# Altium project IMX6 DEV BOARD.PrjPcb (part 2 of 4)

## Sheet dram.SchDoc
size A1; SheetNumber: 7; SheetTotal: 21
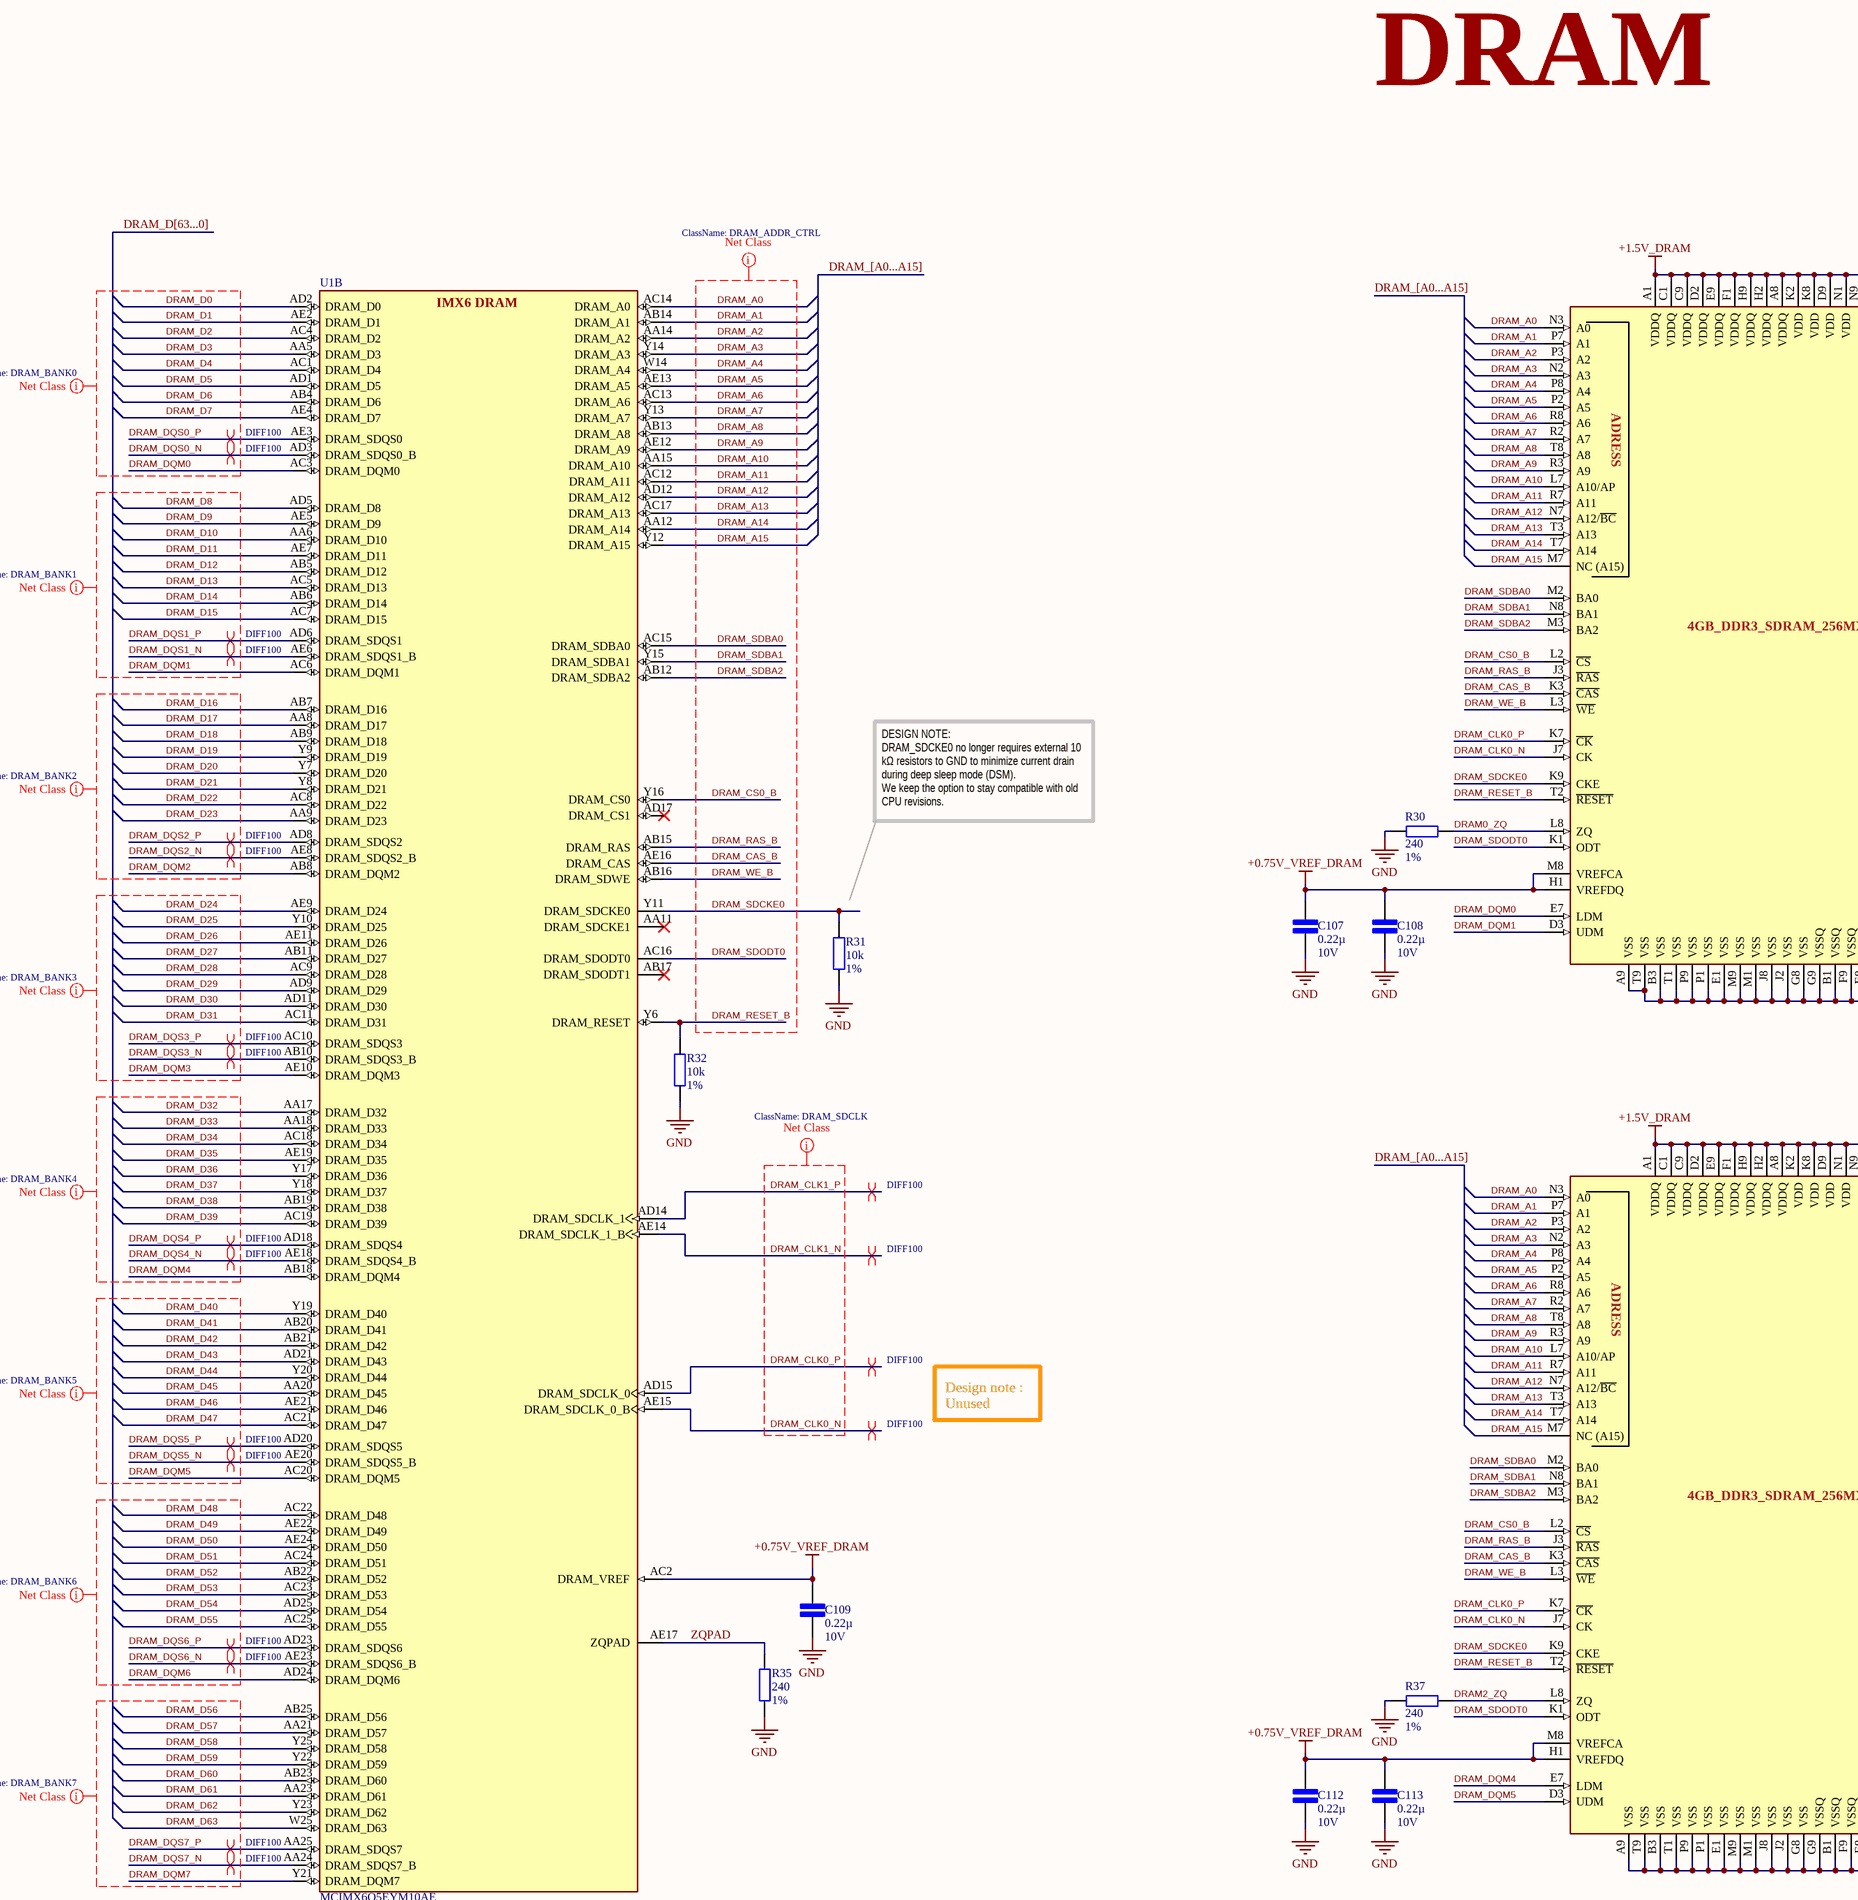
[diagram p6: dram.SchDoc, top left]
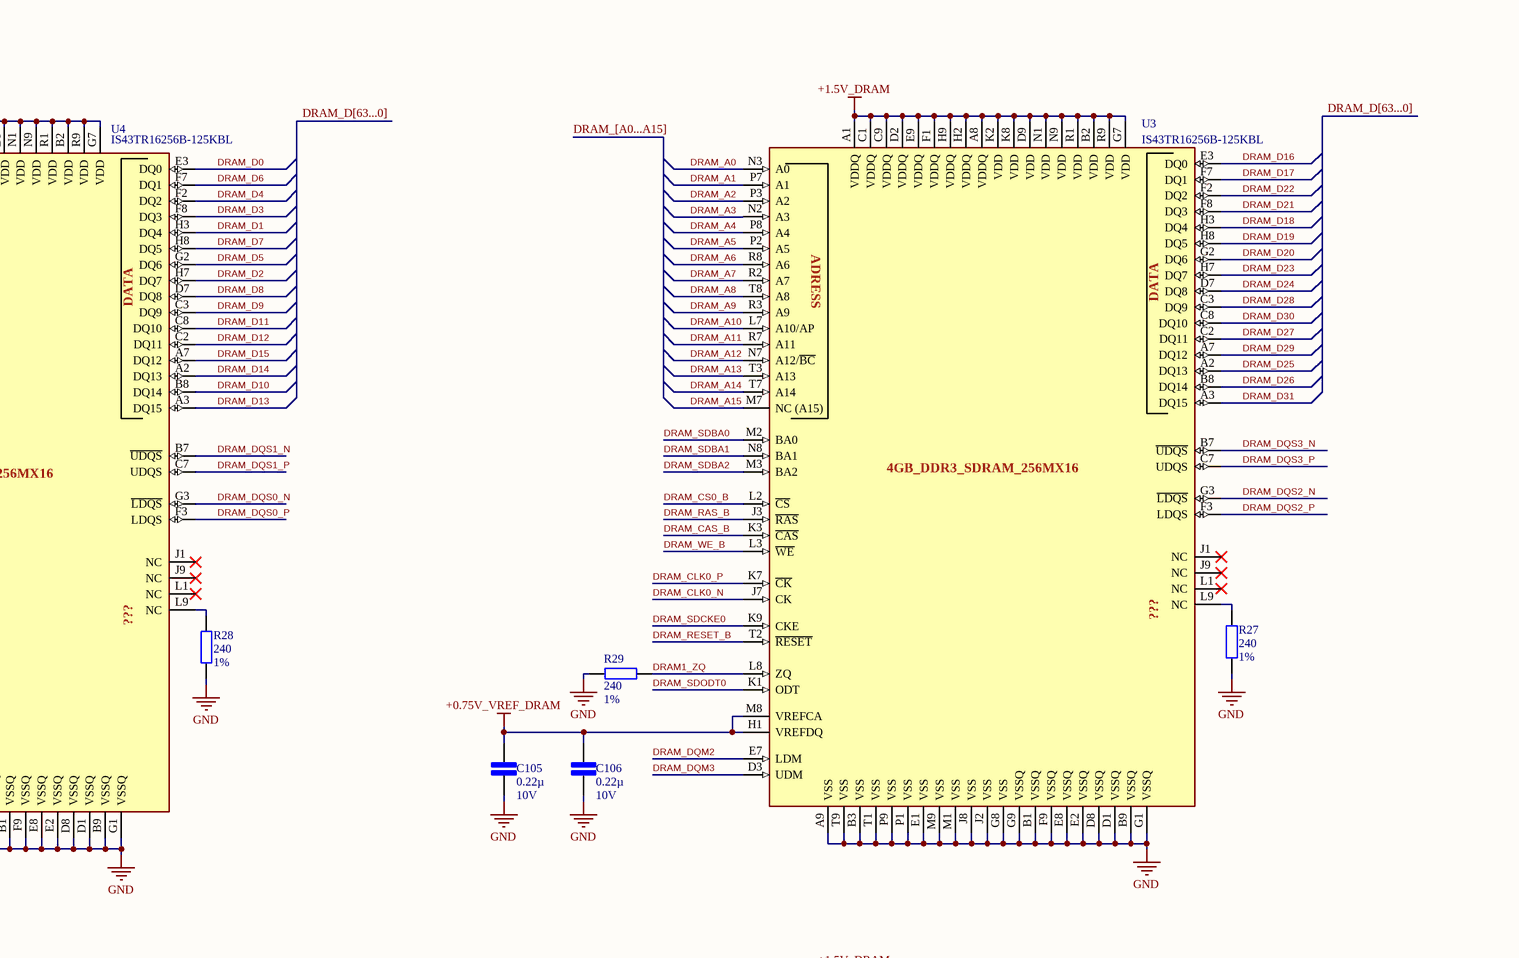
[diagram p7: dram.SchDoc, top right]
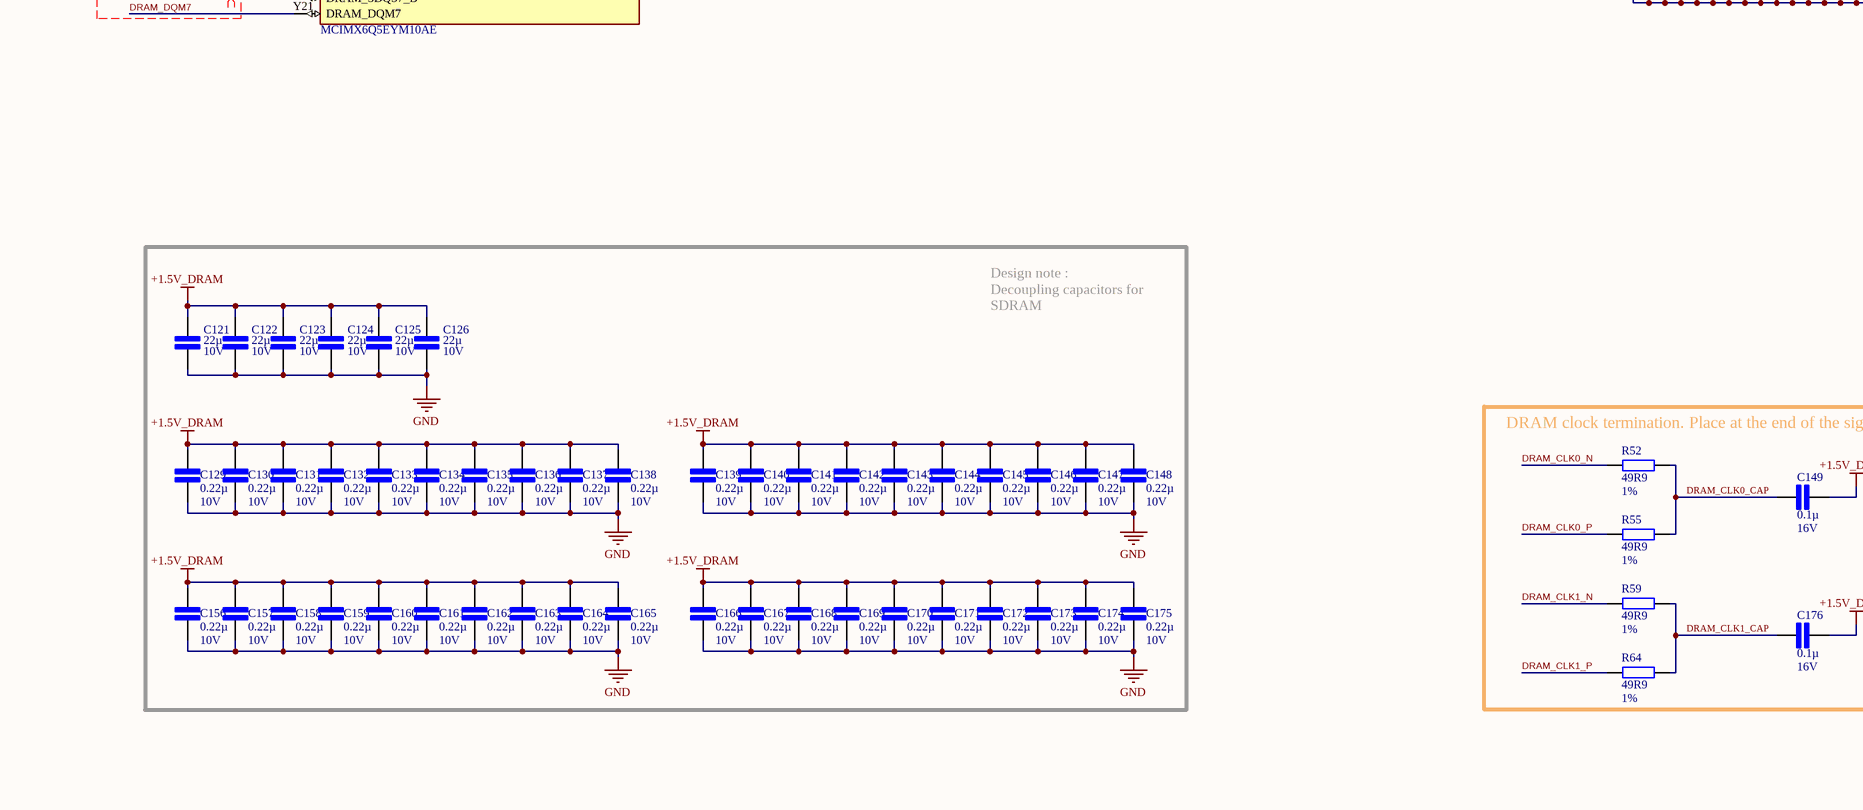
[diagram p8: dram.SchDoc, bottom left]
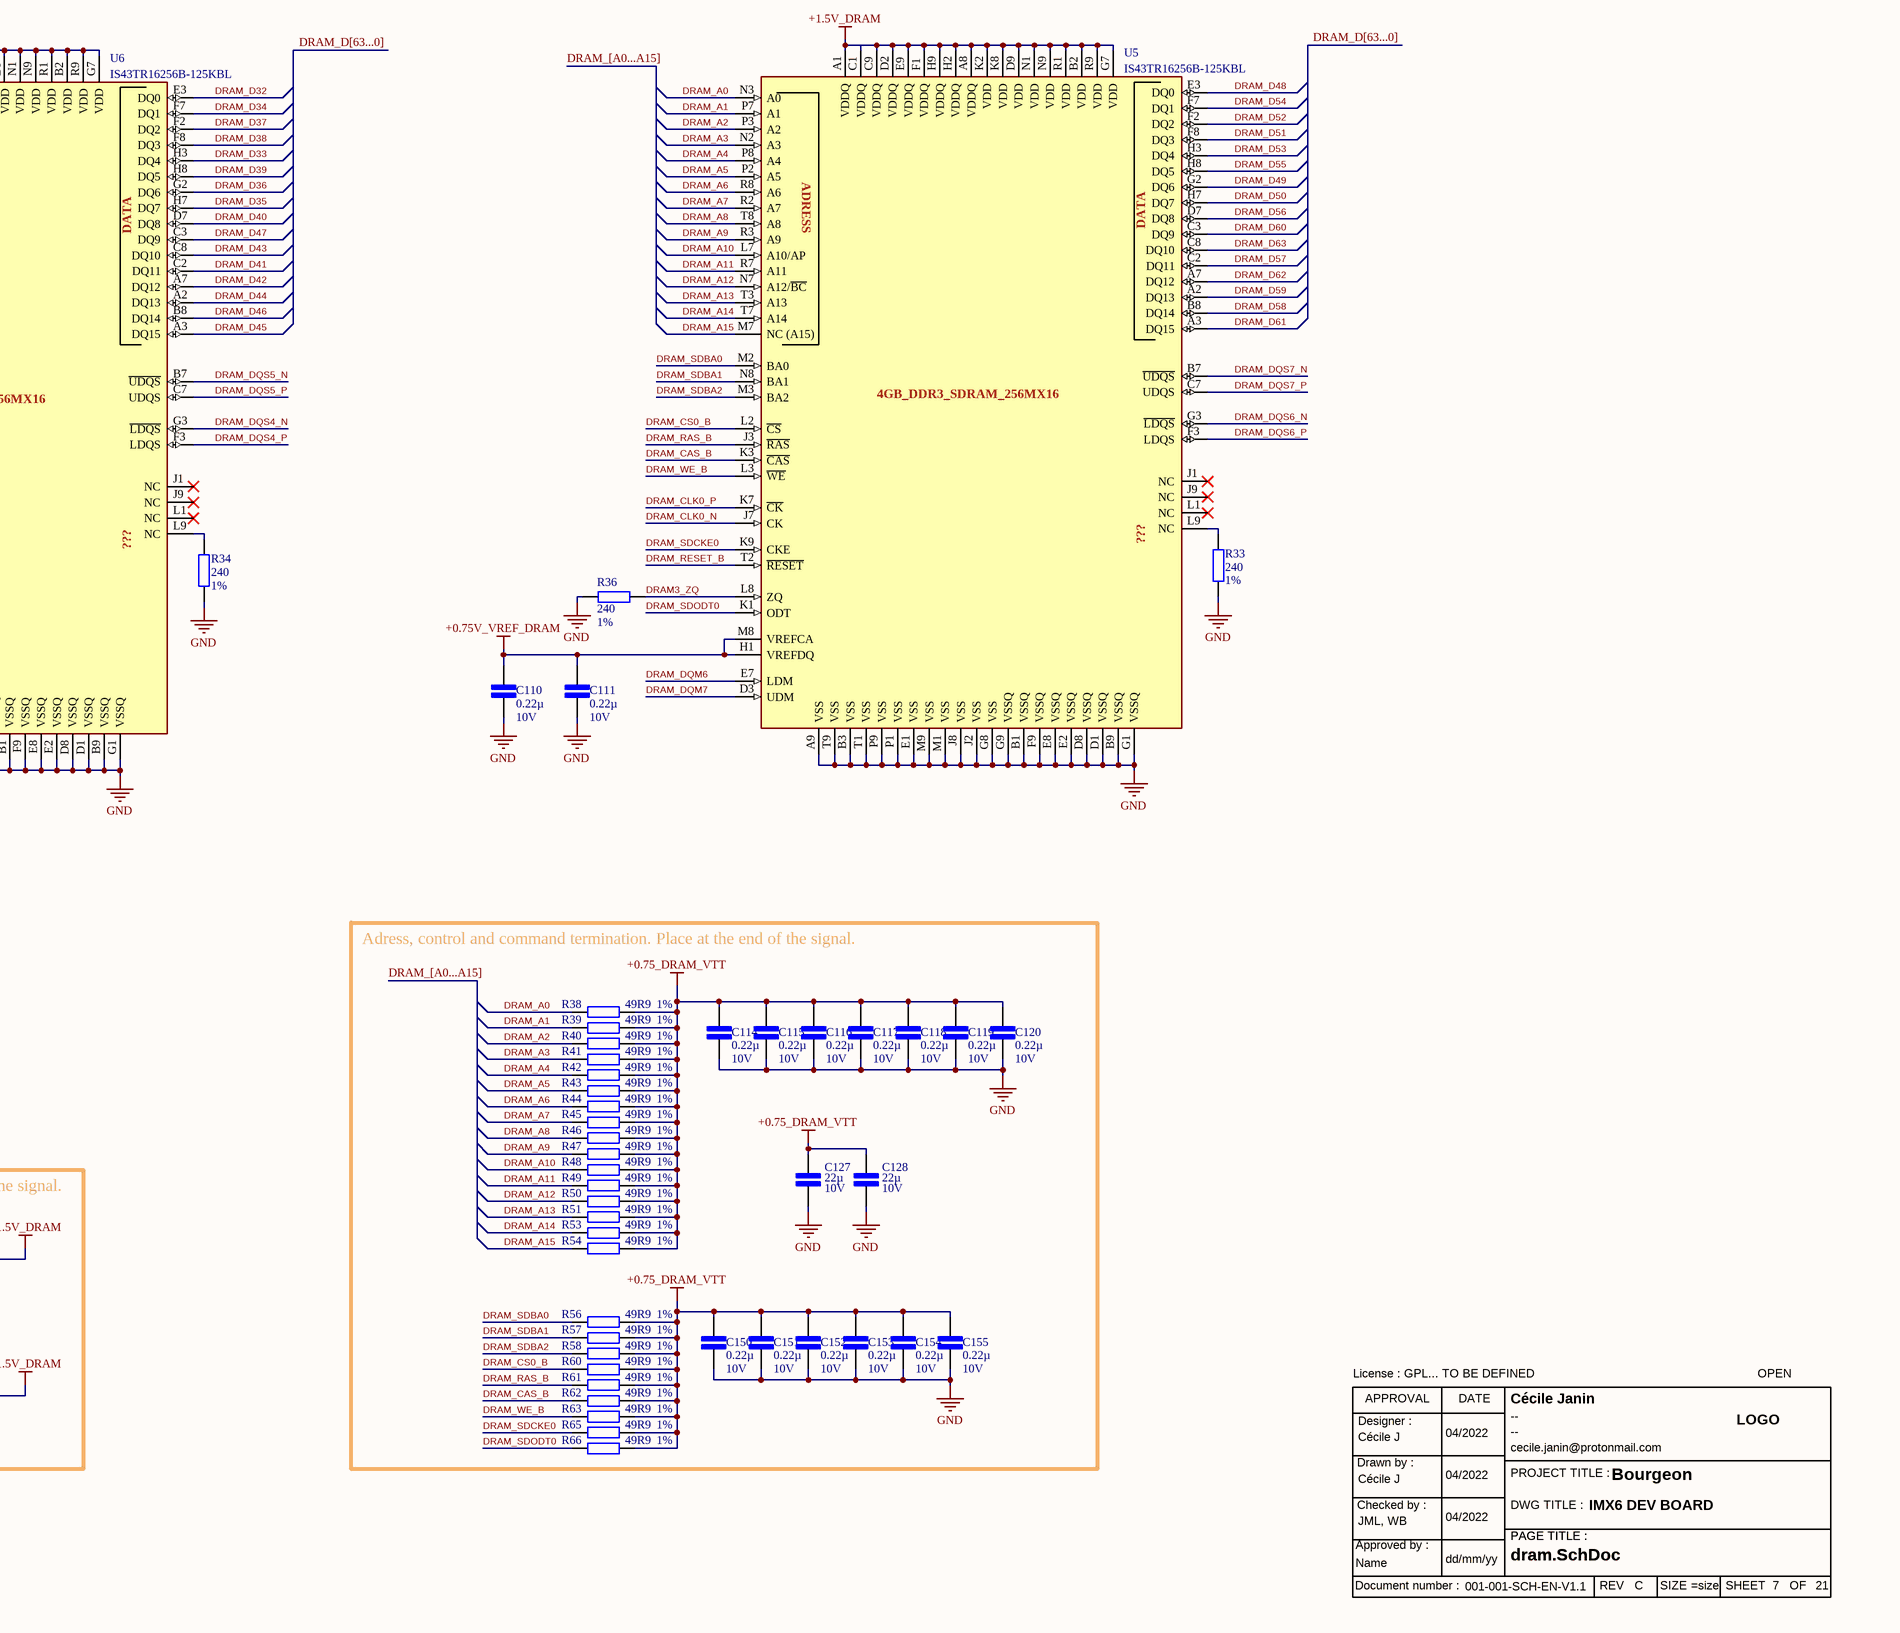
[diagram p9: dram.SchDoc, bottom right]

### Parts
C105  0.22µ  Tension du diélectrique: 10V  [Cap cer 0402/1005]
C106  0.22µ  Tension du diélectrique: 10V  [Cap cer 0402/1005]
C107  0.22µ  Tension du diélectrique: 10V  [Cap cer 0402/1005]
C108  0.22µ  Tension du diélectrique: 10V  [Cap cer 0402/1005]
C109  0.22µ  Tension du diélectrique: 10V  [Cap cer 0402/1005]
C110  0.22µ  Tension du diélectrique: 10V  [Cap cer 0402/1005]
C111  0.22µ  Tension du diélectrique: 10V  [Cap cer 0402/1005]
C112  0.22µ  Tension du diélectrique: 10V  [Cap cer 0402/1005]
C113  0.22µ  Tension du diélectrique: 10V  [Cap cer 0402/1005]
C114  0.22µ  Tension du diélectrique: 10V  [Cap cer 0402/1005]
C115  0.22µ  Tension du diélectrique: 10V  [Cap cer 0402/1005]
C116  0.22µ  Tension du diélectrique: 10V  [Cap cer 0402/1005]
C117  0.22µ  Tension du diélectrique: 10V  [Cap cer 0402/1005]
C118  0.22µ  Tension du diélectrique: 10V  [Cap cer 0402/1005]
C119  0.22µ  Tension du diélectrique: 10V  [Cap cer 0402/1005]
C120  0.22µ  Tension du diélectrique: 10V  [Cap cer 0402/1005]
C121  22µ  Tension du diélectrique: 10V  [Cap cer 0603/4608]
C122  22µ  Tension du diélectrique: 10V  [Cap cer 0603/4608]
C123  22µ  Tension du diélectrique: 10V  [Cap cer 0603/4608]
C124  22µ  Tension du diélectrique: 10V  [Cap cer 0603/4608]
C125  22µ  Tension du diélectrique: 10V  [Cap cer 0603/4608]
C126  22µ  Tension du diélectrique: 10V  [Cap cer 0603/4608]
C127  22µ  Tension du diélectrique: 10V  [Cap cer 0603/4608]
C128  22µ  Tension du diélectrique: 10V  [Cap cer 0603/4608]
C129  0.22µ  Tension du diélectrique: 10V  [Cap cer 0402/1005]
C130  0.22µ  Tension du diélectrique: 10V  [Cap cer 0402/1005]
C131  0.22µ  Tension du diélectrique: 10V  [Cap cer 0402/1005]
C132  0.22µ  Tension du diélectrique: 10V  [Cap cer 0402/1005]
C133  0.22µ  Tension du diélectrique: 10V  [Cap cer 0402/1005]
C134  0.22µ  Tension du diélectrique: 10V  [Cap cer 0402/1005]
C135  0.22µ  Tension du diélectrique: 10V  [Cap cer 0402/1005]
C136  0.22µ  Tension du diélectrique: 10V  [Cap cer 0402/1005]
C137  0.22µ  Tension du diélectrique: 10V  [Cap cer 0402/1005]
C138  0.22µ  Tension du diélectrique: 10V  [Cap cer 0402/1005]
C139  0.22µ  Tension du diélectrique: 10V  [Cap cer 0402/1005]
C140  0.22µ  Tension du diélectrique: 10V  [Cap cer 0402/1005]
C141  0.22µ  Tension du diélectrique: 10V  [Cap cer 0402/1005]
C142  0.22µ  Tension du diélectrique: 10V  [Cap cer 0402/1005]
C143  0.22µ  Tension du diélectrique: 10V  [Cap cer 0402/1005]
C144  0.22µ  Tension du diélectrique: 10V  [Cap cer 0402/1005]
C145  0.22µ  Tension du diélectrique: 10V  [Cap cer 0402/1005]
C146  0.22µ  Tension du diélectrique: 10V  [Cap cer 0402/1005]
C147  0.22µ  Tension du diélectrique: 10V  [Cap cer 0402/1005]
C148  0.22µ  Tension du diélectrique: 10V  [Cap cer 0402/1005]
C149  0.1µ  Tension du diélectrique: 16V  [Cap cer 0402/1005]
C150  0.22µ  Tension du diélectrique: 10V  [Cap cer 0402/1005]
C151  0.22µ  Tension du diélectrique: 10V  [Cap cer 0402/1005]
C152  0.22µ  Tension du diélectrique: 10V  [Cap cer 0402/1005]
C153  0.22µ  Tension du diélectrique: 10V  [Cap cer 0402/1005]
C154  0.22µ  Tension du diélectrique: 10V  [Cap cer 0402/1005]
C155  0.22µ  Tension du diélectrique: 10V  [Cap cer 0402/1005]
C156  0.22µ  Tension du diélectrique: 10V  [Cap cer 0402/1005]
C157  0.22µ  Tension du diélectrique: 10V  [Cap cer 0402/1005]
C158  0.22µ  Tension du diélectrique: 10V  [Cap cer 0402/1005]
C159  0.22µ  Tension du diélectrique: 10V  [Cap cer 0402/1005]
C160  0.22µ  Tension du diélectrique: 10V  [Cap cer 0402/1005]
C161  0.22µ  Tension du diélectrique: 10V  [Cap cer 0402/1005]
C162  0.22µ  Tension du diélectrique: 10V  [Cap cer 0402/1005]
C163  0.22µ  Tension du diélectrique: 10V  [Cap cer 0402/1005]
C164  0.22µ  Tension du diélectrique: 10V  [Cap cer 0402/1005]
C165  0.22µ  Tension du diélectrique: 10V  [Cap cer 0402/1005]
C166  0.22µ  Tension du diélectrique: 10V  [Cap cer 0402/1005]
C167  0.22µ  Tension du diélectrique: 10V  [Cap cer 0402/1005]
C168  0.22µ  Tension du diélectrique: 10V  [Cap cer 0402/1005]
C169  0.22µ  Tension du diélectrique: 10V  [Cap cer 0402/1005]
C170  0.22µ  Tension du diélectrique: 10V  [Cap cer 0402/1005]
C171  0.22µ  Tension du diélectrique: 10V  [Cap cer 0402/1005]
C172  0.22µ  Tension du diélectrique: 10V  [Cap cer 0402/1005]
C173  0.22µ  Tension du diélectrique: 10V  [Cap cer 0402/1005]
C174  0.22µ  Tension du diélectrique: 10V  [Cap cer 0402/1005]
C175  0.22µ  Tension du diélectrique: 10V  [Cap cer 0402/1005]
C176  0.1µ  Tension du diélectrique: 16V  [Cap cer 0402/1005]
R27  240  pourcentage: 1%  [Res 0402/1005]
R28  240  pourcentage: 1%  [Res 0402/1005]
R29  240  pourcentage: 1%  [Res 0402/1005]
R30  240  pourcentage: 1%  [Res 0402/1005]
R31  10k  pourcentage: 1%  [Res 0402/1005]
R32  10k  pourcentage: 1%  [Res 0402/1005]
R33  240  pourcentage: 1%  [Res 0402/1005]
R34  240  pourcentage: 1%  [Res 0402/1005]
R35  240  pourcentage: 1%  [Res 0402/1005]
R36  240  pourcentage: 1%  [Res 0402/1005]
R37  240  pourcentage: 1%  [Res 0402/1005]
R38  49R9  pourcentage: 1%  [Res 0402/1005]
R39  49R9  pourcentage: 1%  [Res 0402/1005]
R40  49R9  pourcentage: 1%  [Res 0402/1005]
R41  49R9  pourcentage: 1%  [Res 0402/1005]
R42  49R9  pourcentage: 1%  [Res 0402/1005]
R43  49R9  pourcentage: 1%  [Res 0402/1005]
R44  49R9  pourcentage: 1%  [Res 0402/1005]
R45  49R9  pourcentage: 1%  [Res 0402/1005]
R46  49R9  pourcentage: 1%  [Res 0402/1005]
R47  49R9  pourcentage: 1%  [Res 0402/1005]
R48  49R9  pourcentage: 1%  [Res 0402/1005]
R49  49R9  pourcentage: 1%  [Res 0402/1005]
R50  49R9  pourcentage: 1%  [Res 0402/1005]
R51  49R9  pourcentage: 1%  [Res 0402/1005]
R52  49R9  pourcentage: 1%  [Res 0402/1005]
R53  49R9  pourcentage: 1%  [Res 0402/1005]
R54  49R9  pourcentage: 1%  [Res 0402/1005]
R55  49R9  pourcentage: 1%  [Res 0402/1005]
R56  49R9  pourcentage: 1%  [Res 0402/1005]
R57  49R9  pourcentage: 1%  [Res 0402/1005]
R58  49R9  pourcentage: 1%  [Res 0402/1005]
R59  49R9  pourcentage: 1%  [Res 0402/1005]
R60  49R9  pourcentage: 1%  [Res 0402/1005]
R61  49R9  pourcentage: 1%  [Res 0402/1005]
R62  49R9  pourcentage: 1%  [Res 0402/1005]
R63  49R9  pourcentage: 1%  [Res 0402/1005]
R64  49R9  pourcentage: 1%  [Res 0402/1005]
R65  49R9  pourcentage: 1%  [Res 0402/1005]
R66  49R9  pourcentage: 1%  [Res 0402/1005]
TB5  Title bloc ANSI modified  (value not drawn)
U1  MCIMX6Q5EYM10AE  [FRES-2197-01]  (part B of 21)
U3  IS43TR16256B-125KBL  [BGA-96 DDR3]
U4  IS43TR16256B-125KBL  [BGA-96 DDR3]
U5  IS43TR16256B-125KBL  [BGA-96 DDR3]
U6  IS43TR16256B-125KBL  [BGA-96 DDR3]

### Blocks framed on the sheet
DRAM clock termination. Place at the end of the signal.: C149 C176 R52 R55 R59 R64

### Nets
+0.75_DRAM_VTT: C114.1 C115.1 C116.1 C117.1 C118.1 C119.1 C120.1 C127.1 C128.1 C150.1 C151.1 C152.1 C153.1 C154.1 C155.1 R38.2 R39.2 R40.2 R41.2 R42.2 R43.2 R44.2 R45.2 R46.2 R47.2 R48.2 R49.2 R50.2 R51.2 R53.2 R54.2 R56.2 R57.2 R58.2 R60.2 R61.2 R62.2 R63.2 R65.2 R66.2
+0.75V_VREF_DRAM: C105.1 C106.1 C107.1 C108.1 C109.1 C110.1 C111.1 C112.1 C113.1 U1.AC2(DRAM_VREF) U3.H1(VREFDQ) U3.M8(VREFCA) U4.H1(VREFDQ) U4.M8(VREFCA) U5.H1(VREFDQ) U5.M8(VREFCA) U6.H1(VREFDQ) U6.M8(VREFCA)
+1.5V_DRAM: C121.1 C122.1 C123.1 C124.1 C125.1 C126.1 C129.1 C130.1 C131.1 C132.1 C133.1 C134.1 C135.1 C136.1 C137.1 C138.1 C139.1 C140.1 C141.1 C142.1 C143.1 C144.1 C145.1 C146.1 C147.1 C148.1 C149.2 C156.1 C157.1 C158.1 C159.1 C160.1 C161.1 C162.1 C163.1 C164.1 C165.1 C166.1 C167.1 C168.1 C169.1 C170.1 C171.1 C172.1 C173.1 C174.1 C175.1 C176.2 U3.A1(VDDQ) U3.A8(VDDQ) U3.B2(VDD) U3.C1(VDDQ) U3.C9(VDDQ) U3.D2(VDDQ) U3.D9(VDD) U3.E9(VDDQ) U3.F1(VDDQ) U3.G7(VDD) U3.H2(VDDQ) U3.H9(VDDQ) U3.K2(VDD) U3.K8(VDD) U3.N1(VDD) U3.N9(VDD) U3.R1(VDD) U3.R9(VDD) U4.A1(VDDQ) U4.A8(VDDQ) U4.B2(VDD) U4.C1(VDDQ) U4.C9(VDDQ) U4.D2(VDDQ) U4.D9(VDD) U4.E9(VDDQ) U4.F1(VDDQ) U4.G7(VDD) U4.H2(VDDQ) U4.H9(VDDQ) U4.K2(VDD) U4.K8(VDD) U4.N1(VDD) U4.N9(VDD) U4.R1(VDD) U4.R9(VDD) U5.A1(VDDQ) U5.A8(VDDQ) U5.B2(VDD) U5.C1(VDDQ) U5.C9(VDDQ) U5.D2(VDDQ) U5.D9(VDD) U5.E9(VDDQ) U5.F1(VDDQ) U5.G7(VDD) U5.H2(VDDQ) U5.H9(VDDQ) U5.K2(VDD) U5.K8(VDD) U5.N1(VDD) U5.N9(VDD) U5.R1(VDD) U5.R9(VDD) U6.A1(VDDQ) U6.A8(VDDQ) U6.B2(VDD) U6.C1(VDDQ) U6.C9(VDDQ) U6.D2(VDDQ) U6.D9(VDD) U6.E9(VDDQ) U6.F1(VDDQ) U6.G7(VDD) U6.H2(VDDQ) U6.H9(VDDQ) U6.K2(VDD) U6.K8(VDD) U6.N1(VDD) U6.N9(VDD) U6.R1(VDD) U6.R9(VDD)
GND: C105.2 C106.2 C107.2 C108.2 C109.2 C110.2 C111.2 C112.2 C113.2 C114.2 C115.2 C116.2 C117.2 C118.2 C119.2 C120.2 C121.2 C122.2 C123.2 C124.2 C125.2 C126.2 C127.2 C128.2 C129.2 C130.2 C131.2 C132.2 C133.2 C134.2 C135.2 C136.2 C137.2 C138.2 C139.2 C140.2 C141.2 C142.2 C143.2 C144.2 C145.2 C146.2 C147.2 C148.2 C150.2 C151.2 C152.2 C153.2 C154.2 C155.2 C156.2 C157.2 C158.2 C159.2 C160.2 C161.2 C162.2 C163.2 C164.2 C165.2 C166.2 C167.2 C168.2 C169.2 C170.2 C171.2 C172.2 C173.2 C174.2 C175.2 R27.1 R28.1 R29.1 R30.1 R31.1 R32.1 R33.1 R34.1 R35.1 R36.1 R37.1 U3.A9(VSS) U3.B1(VSSQ) U3.B3(VSS) U3.B9(VSSQ) U3.D1(VSSQ) U3.D8(VSSQ) U3.E1(VSS) U3.E2(VSSQ) U3.E8(VSSQ) U3.F9(VSSQ) U3.G1(VSSQ) U3.G8(VSS) U3.G9(VSSQ) U3.J2(VSS) U3.J8(VSS) U3.M1(VSS) U3.M9(VSS) U3.P1(VSS) U3.P9(VSS) U3.T1(VSS) U3.T9(VSS) U4.A9(VSS) U4.B1(VSSQ) U4.B3(VSS) U4.B9(VSSQ) U4.D1(VSSQ) U4.D8(VSSQ) U4.E1(VSS) U4.E2(VSSQ) U4.E8(VSSQ) U4.F9(VSSQ) U4.G1(VSSQ) U4.G8(VSS) U4.G9(VSSQ) U4.J2(VSS) U4.J8(VSS) U4.M1(VSS) U4.M9(VSS) U4.P1(VSS) U4.P9(VSS) U4.T1(VSS) U4.T9(VSS) U5.A9(VSS) U5.B1(VSSQ) U5.B3(VSS) U5.B9(VSSQ) U5.D1(VSSQ) U5.D8(VSSQ) U5.E1(VSS) U5.E2(VSSQ) U5.E8(VSSQ) U5.F9(VSSQ) U5.G1(VSSQ) U5.G8(VSS) U5.G9(VSSQ) U5.J2(VSS) U5.J8(VSS) U5.M1(VSS) U5.M9(VSS) U5.P1(VSS) U5.P9(VSS) U5.T1(VSS) U5.T9(VSS) U6.A9(VSS) U6.B1(VSSQ) U6.B3(VSS) U6.B9(VSSQ) U6.D1(VSSQ) U6.D8(VSSQ) U6.E1(VSS) U6.E2(VSSQ) U6.E8(VSSQ) U6.F9(VSSQ) U6.G1(VSSQ) U6.G8(VSS) U6.G9(VSSQ) U6.J2(VSS) U6.J8(VSS) U6.M1(VSS) U6.M9(VSS) U6.P1(VSS) U6.P9(VSS) U6.T1(VSS) U6.T9(VSS)
DRAM0_ZQ: R30.2 U4.L8(ZQ)
DRAM1_ZQ: R29.2 U3.L8(ZQ)
DRAM2_ZQ: R37.2 U6.L8(ZQ)
DRAM3_ZQ: R36.2 U5.L8(ZQ)
DRAM_A0: R38.1 U1.AC14(DRAM_A0) U3.N3(A0) U4.N3(A0) U5.N3(A0) U6.N3(A0)
DRAM_A1: R39.1 U1.AB14(DRAM_A1) U3.P7(A1) U4.P7(A1) U5.P7(A1) U6.P7(A1)
DRAM_A2: R40.1 U1.AA14(DRAM_A2) U3.P3(A2) U4.P3(A2) U5.P3(A2) U6.P3(A2)
DRAM_A3: R41.1 U1.Y14(DRAM_A3) U3.N2(A3) U4.N2(A3) U5.N2(A3) U6.N2(A3)
DRAM_A4: R42.1 U1.W14(DRAM_A4) U3.P8(A4) U4.P8(A4) U5.P8(A4) U6.P8(A4)
DRAM_A5: R43.1 U1.AE13(DRAM_A5) U3.P2(A5) U4.P2(A5) U5.P2(A5) U6.P2(A5)
DRAM_A6: R44.1 U1.AC13(DRAM_A6) U3.R8(A6) U4.R8(A6) U5.R8(A6) U6.R8(A6)
DRAM_A7: R45.1 U1.Y13(DRAM_A7) U3.R2(A7) U4.R2(A7) U5.R2(A7) U6.R2(A7)
DRAM_A8: R46.1 U1.AB13(DRAM_A8) U3.T8(A8) U4.T8(A8) U5.T8(A8) U6.T8(A8)
DRAM_A9: R47.1 U1.AE12(DRAM_A9) U3.R3(A9) U4.R3(A9) U5.R3(A9) U6.R3(A9)
DRAM_A10: R48.1 U1.AA15(DRAM_A10) U3.L7(A10/AP) U4.L7(A10/AP) U5.L7(A10/AP) U6.L7(A10/AP)
DRAM_A11: R49.1 U1.AC12(DRAM_A11) U3.R7(A11) U4.R7(A11) U5.R7(A11) U6.R7(A11)
DRAM_A12: R50.1 U1.AD12(DRAM_A12) U3.N7(A12/~{BC}) U4.N7(A12/~{BC}) U5.N7(A12/~{BC}) U6.N7(A12/~{BC})
DRAM_A13: R51.1 U1.AC17(DRAM_A13) U3.T3(A13) U4.T3(A13) U5.T3(A13) U6.T3(A13)
DRAM_A14: R53.1 U1.AA12(DRAM_A14) U3.T7(A14) U4.T7(A14) U5.T7(A14) U6.T7(A14)
DRAM_A15: R54.1 U1.Y12(DRAM_A15) U3.M7(NC_(A15)) U4.M7(NC_(A15)) U5.M7(NC_(A15)) U6.M7(NC_(A15))
DRAM_CAS_B: R62.1 U1.AE16(DRAM_CAS) U3.K3(~{CAS}) U4.K3(~{CAS}) U5.K3(~{CAS}) U6.K3(~{CAS})
DRAM_CLK0_CAP: C149.1 R52.2 R55.2
DRAM_CLK0_N: R52.1 U1.AE15(DRAM_SDCLK_0_B) U3.J7(CK) U4.J7(CK) U5.J7(CK) U6.J7(CK)
DRAM_CLK0_P: R55.1 U1.AD15(DRAM_SDCLK_0) U3.K7(~{CK}) U4.K7(~{CK}) U5.K7(~{CK}) U6.K7(~{CK})
DRAM_CLK1_CAP: C176.1 R59.2 R64.2
DRAM_CLK1_N: R59.1 U1.AE14(DRAM_SDCLK_1_B)
DRAM_CLK1_P: R64.1 U1.AD14(DRAM_SDCLK_1)
DRAM_CS0_B: R60.1 U1.Y16(DRAM_CS0) U3.L2(~{CS}) U4.L2(~{CS}) U5.L2(~{CS}) U6.L2(~{CS})
DRAM_D0: U1.AD2(DRAM_D0) U4.E3(DQ0)
DRAM_D1: U1.AE2(DRAM_D1) U4.H3(DQ4)
DRAM_D2: U1.AC4(DRAM_D2) U4.H7(DQ7)
DRAM_D3: U1.AA5(DRAM_D3) U4.F8(DQ3)
DRAM_D4: U1.AC1(DRAM_D4) U4.F2(DQ2)
DRAM_D5: U1.AD1(DRAM_D5) U4.G2(DQ6)
DRAM_D6: U1.AB4(DRAM_D6) U4.F7(DQ1)
DRAM_D7: U1.AE4(DRAM_D7) U4.H8(DQ5)
DRAM_D8: U1.AD5(DRAM_D8) U4.D7(DQ8)
DRAM_D9: U1.AE5(DRAM_D9) U4.C3(DQ9)
DRAM_D10: U1.AA6(DRAM_D10) U4.B8(DQ14)
DRAM_D11: U1.AE7(DRAM_D11) U4.C8(DQ10)
DRAM_D12: U1.AB5(DRAM_D12) U4.C2(DQ11)
DRAM_D13: U1.AC5(DRAM_D13) U4.A3(DQ15)
DRAM_D14: U1.AB6(DRAM_D14) U4.A2(DQ13)
DRAM_D15: U1.AC7(DRAM_D15) U4.A7(DQ12)
DRAM_D16: U1.AB7(DRAM_D16) U3.E3(DQ0)
DRAM_D17: U1.AA8(DRAM_D17) U3.F7(DQ1)
DRAM_D18: U1.AB9(DRAM_D18) U3.H3(DQ4)
DRAM_D19: U1.Y9(DRAM_D19) U3.H8(DQ5)
DRAM_D20: U1.Y7(DRAM_D20) U3.G2(DQ6)
DRAM_D21: U1.Y8(DRAM_D21) U3.F8(DQ3)
DRAM_D22: U1.AC8(DRAM_D22) U3.F2(DQ2)
DRAM_D23: U1.AA9(DRAM_D23) U3.H7(DQ7)
DRAM_D24: U1.AE9(DRAM_D24) U3.D7(DQ8)
DRAM_D25: U1.Y10(DRAM_D25) U3.A2(DQ13)
DRAM_D26: U1.AE11(DRAM_D26) U3.B8(DQ14)
DRAM_D27: U1.AB11(DRAM_D27) U3.C2(DQ11)
DRAM_D28: U1.AC9(DRAM_D28) U3.C3(DQ9)
DRAM_D29: U1.AD9(DRAM_D29) U3.A7(DQ12)
DRAM_D30: U1.AD11(DRAM_D30) U3.C8(DQ10)
DRAM_D31: U1.AC11(DRAM_D31) U3.A3(DQ15)
DRAM_D32: U1.AA17(DRAM_D32) U6.E3(DQ0)
DRAM_D33: U1.AA18(DRAM_D33) U6.H3(DQ4)
DRAM_D34: U1.AC18(DRAM_D34) U6.F7(DQ1)
DRAM_D35: U1.AE19(DRAM_D35) U6.H7(DQ7)
DRAM_D36: U1.Y17(DRAM_D36) U6.G2(DQ6)
DRAM_D37: U1.Y18(DRAM_D37) U6.F2(DQ2)
DRAM_D38: U1.AB19(DRAM_D38) U6.F8(DQ3)
DRAM_D39: U1.AC19(DRAM_D39) U6.H8(DQ5)
DRAM_D40: U1.Y19(DRAM_D40) U6.D7(DQ8)
DRAM_D41: U1.AB20(DRAM_D41) U6.C2(DQ11)
DRAM_D42: U1.AB21(DRAM_D42) U6.A7(DQ12)
DRAM_D43: U1.AD21(DRAM_D43) U6.C8(DQ10)
DRAM_D44: U1.Y20(DRAM_D44) U6.A2(DQ13)
DRAM_D45: U1.AA20(DRAM_D45) U6.A3(DQ15)
DRAM_D46: U1.AE21(DRAM_D46) U6.B8(DQ14)
DRAM_D47: U1.AC21(DRAM_D47) U6.C3(DQ9)
DRAM_D48: U1.AC22(DRAM_D48) U5.E3(DQ0)
DRAM_D49: U1.AE22(DRAM_D49) U5.G2(DQ6)
DRAM_D50: U1.AE24(DRAM_D50) U5.H7(DQ7)
DRAM_D51: U1.AC24(DRAM_D51) U5.F8(DQ3)
DRAM_D52: U1.AB22(DRAM_D52) U5.F2(DQ2)
DRAM_D53: U1.AC23(DRAM_D53) U5.H3(DQ4)
DRAM_D54: U1.AD25(DRAM_D54) U5.F7(DQ1)
DRAM_D55: U1.AC25(DRAM_D55) U5.H8(DQ5)
DRAM_D56: U1.AB25(DRAM_D56) U5.D7(DQ8)
DRAM_D57: U1.AA21(DRAM_D57) U5.C2(DQ11)
DRAM_D58: U1.Y25(DRAM_D58) U5.B8(DQ14)
DRAM_D59: U1.Y22(DRAM_D59) U5.A2(DQ13)
DRAM_D60: U1.AB23(DRAM_D60) U5.C3(DQ9)
DRAM_D61: U1.AA23(DRAM_D61) U5.A3(DQ15)
DRAM_D62: U1.Y23(DRAM_D62) U5.A7(DQ12)
DRAM_D63: U1.W25(DRAM_D63) U5.C8(DQ10)
DRAM_DQM0: U1.AC3(DRAM_DQM0) U4.E7(LDM)
DRAM_DQM1: U1.AC6(DRAM_DQM1) U4.D3(UDM)
DRAM_DQM2: U1.AB8(DRAM_DQM2) U3.E7(LDM)
DRAM_DQM3: U1.AE10(DRAM_DQM3) U3.D3(UDM)
DRAM_DQM4: U1.AB18(DRAM_DQM4) U6.E7(LDM)
DRAM_DQM5: U1.AC20(DRAM_DQM5) U6.D3(UDM)
DRAM_DQM6: U1.AD24(DRAM_DQM6) U5.E7(LDM)
DRAM_DQM7: U1.Y21(DRAM_DQM7) U5.D3(UDM)
DRAM_DQS0_N: U1.AD3(DRAM_SDQS0_B) U4.G3(~{LDQS})
DRAM_DQS0_P: U1.AE3(DRAM_SDQS0) U4.F3(LDQS)
DRAM_DQS1_N: U1.AE6(DRAM_SDQS1_B) U4.B7(~{UDQS})
DRAM_DQS1_P: U1.AD6(DRAM_SDQS1) U4.C7(UDQS)
DRAM_DQS2_N: U1.AE8(DRAM_SDQS2_B) U3.G3(~{LDQS})
DRAM_DQS2_P: U1.AD8(DRAM_SDQS2) U3.F3(LDQS)
DRAM_DQS3_N: U1.AB10(DRAM_SDQS3_B) U3.B7(~{UDQS})
DRAM_DQS3_P: U1.AC10(DRAM_SDQS3) U3.C7(UDQS)
DRAM_DQS4_N: U1.AE18(DRAM_SDQS4_B) U6.G3(~{LDQS})
DRAM_DQS4_P: U1.AD18(DRAM_SDQS4) U6.F3(LDQS)
DRAM_DQS5_N: U1.AE20(DRAM_SDQS5_B) U6.B7(~{UDQS})
DRAM_DQS5_P: U1.AD20(DRAM_SDQS5) U6.C7(UDQS)
DRAM_DQS6_N: U1.AE23(DRAM_SDQS6_B) U5.G3(~{LDQS})
DRAM_DQS6_P: U1.AD23(DRAM_SDQS6) U5.F3(LDQS)
DRAM_DQS7_N: U1.AA24(DRAM_SDQS7_B) U5.B7(~{UDQS})
DRAM_DQS7_P: U1.AA25(DRAM_SDQS7) U5.C7(UDQS)
DRAM_RAS_B: R61.1 U1.AB15(DRAM_RAS) U3.J3(~{RAS}) U4.J3(~{RAS}) U5.J3(~{RAS}) U6.J3(~{RAS})
DRAM_RESET_B: R32.2 U1.Y6(DRAM_RESET) U3.T2(~{RESET}) U4.T2(~{RESET}) U5.T2(~{RESET}) U6.T2(~{RESET})
DRAM_SDBA0: R56.1 U1.AC15(DRAM_SDBA0) U3.M2(BA0) U4.M2(BA0) U5.M2(BA0) U6.M2(BA0)
DRAM_SDBA1: R57.1 U1.Y15(DRAM_SDBA1) U3.N8(BA1) U4.N8(BA1) U5.N8(BA1) U6.N8(BA1)
DRAM_SDBA2: R58.1 U1.AB12(DRAM_SDBA2) U3.M3(BA2) U4.M3(BA2) U5.M3(BA2) U6.M3(BA2)
DRAM_SDCKE0: R31.2 R65.1 U1.Y11(DRAM_SDCKE0) U3.K9(CKE) U4.K9(CKE) U5.K9(CKE) U6.K9(CKE)
DRAM_SDODT0: R66.1 U1.AC16(DRAM_SDODT0) U3.K1(ODT) U4.K1(ODT) U5.K1(ODT) U6.K1(ODT)
DRAM_WE_B: R63.1 U1.AB16(DRAM_SDWE) U3.L3(~{WE}) U4.L3(~{WE}) U5.L3(~{WE}) U6.L3(~{WE})
ZQPAD: R35.2 U1.AE17(ZQPAD)
NetR27_2: R27.2 U3.L9(NC)
NetR28_2: R28.2 U4.L9(NC)
NetR33_2: R33.2 U5.L9(NC)
NetR34_2: R34.2 U6.L9(NC)

Not connected (* = marked no-connect by the designer): U1 AA11(DRAM_SDCKE1)* AB17(DRAM_SDODT1)* AD17(DRAM_CS1)*; U3 J1(NC)* J9(NC)* L1(NC)*; U4 J1(NC)* J9(NC)* L1(NC)*; U5 J1(NC)* J9(NC)* L1(NC)*; U6 J1(NC)* J9(NC)* L1(NC)*

### Buses and harness runs
bus DRAM_[A0...A15]
bus DRAM_D[63...0]

### Layout directives
net class DRAM_ADDR_CTRL: DRAM_A0, DRAM_A1, DRAM_A2, DRAM_A3, DRAM_A4, DRAM_A5, DRAM_A6, DRAM_A7, DRAM_A8, DRAM_A9, DRAM_A10, DRAM_A11, DRAM_A12, DRAM_A13, DRAM_A14, DRAM_A15, DRAM_CAS_B, DRAM_CS0_B, DRAM_RAS_B, DRAM_RESET_B, DRAM_SDBA0, DRAM_SDBA1, DRAM_SDBA2, DRAM_SDCKE0, DRAM_SDODT0, DRAM_WE_B
net class DRAM_SDCLK: DRAM_CLK0_N, DRAM_CLK0_P, DRAM_CLK1_N, DRAM_CLK1_P
net class DRAM_BANK0: DRAM_D0, DRAM_D1, DRAM_D2, DRAM_D3, DRAM_D4, DRAM_D5, DRAM_D6, DRAM_D7, DRAM_DQM0, DRAM_DQS0_N, DRAM_DQS0_P
net class DRAM_BANK1: DRAM_D8, DRAM_D9, DRAM_D10, DRAM_D11, DRAM_D12, DRAM_D13, DRAM_D14, DRAM_D15, DRAM_DQM1, DRAM_DQS1_N, DRAM_DQS1_P
net class DRAM_BANK2: DRAM_D16, DRAM_D17, DRAM_D18, DRAM_D19, DRAM_D20, DRAM_D21, DRAM_D22, DRAM_D23, DRAM_DQM2, DRAM_DQS2_N, DRAM_DQS2_P
net class DRAM_BANK3: DRAM_D24, DRAM_D25, DRAM_D26, DRAM_D27, DRAM_D28, DRAM_D29, DRAM_D30, DRAM_D31, DRAM_DQM3, DRAM_DQS3_N, DRAM_DQS3_P
net class DRAM_BANK4: DRAM_D32, DRAM_D33, DRAM_D34, DRAM_D35, DRAM_D36, DRAM_D37, DRAM_D38, DRAM_D39, DRAM_DQM4, DRAM_DQS4_N, DRAM_DQS4_P
net class DRAM_BANK5: DRAM_D40, DRAM_D41, DRAM_D42, DRAM_D43, DRAM_D44, DRAM_D45, DRAM_D46, DRAM_D47, DRAM_DQM5, DRAM_DQS5_N, DRAM_DQS5_P
net class DRAM_BANK6: DRAM_D48, DRAM_D49, DRAM_D50, DRAM_D51, DRAM_D52, DRAM_D53, DRAM_D54, DRAM_D55, DRAM_DQM6, DRAM_DQS6_N, DRAM_DQS6_P
net class DRAM_BANK7: DRAM_D56, DRAM_D57, DRAM_D58, DRAM_D59, DRAM_D60, DRAM_D61, DRAM_D62, DRAM_D63, DRAM_DQM7, DRAM_DQS7_N, DRAM_DQS7_P
differential pair; differential pair class DIFF100: DRAM_CLK0_N, DRAM_CLK0_P, DRAM_CLK1_N, DRAM_CLK1_P, DRAM_DQS0_N, DRAM_DQS0_P, DRAM_DQS1_N, DRAM_DQS1_P, DRAM_DQS2_N, DRAM_DQS2_P, DRAM_DQS3_N, DRAM_DQS3_P, DRAM_DQS4_N, DRAM_DQS4_P, DRAM_DQS5_N, DRAM_DQS5_P, DRAM_DQS6_N, DRAM_DQS6_P, DRAM_DQS7_N, DRAM_DQS7_P

### Notes on the sheet
- DRAM
- DESIGN NOTE:
  DRAM_SDCKE0 no longer requires external 10 kΩ resistors to GND to minimize current drain during deep sleep mode (DSM).
  We keep the option to stay compatible with old CPU revisions.
- Design note :
  Unused
- Adress, control and command termination. Place at the end of the signal.
- Design note :
  Decoupling capacitors for SDRAM
- (in symbol DDR3) ADRESS; DATA; 4GB_DDR3_SDRAM_256MX16; ???
- (in symbol IMX6Q5EYM10AE, part B) IMX6 DRAM
- (in symbol Title bloc ANSI) APPROVAL; DATE; Designer :; LOGO; Drawn by :; PROJECT TITLE :; Checked by :; DWG TITLE :; PAGE TITLE :; Approved by :; Document number :; REV; SIZE; SHEET; OF

### Library data of the parts
C105-C120 C129-C148 C150-C175 = cap 0.22µ 10V: cap cer 0.22µ 10V 10% X5R 0402; Diélectrique: X5R
C121-C128 = cap 22µ 10V: cap cer 22µ 10V 10% X5R 0603; Diélectrique: X5R
C149 C176 = cap 0.1µ 16V: cap solid electrolyte 0.1µ 6.3V 10%; Diélectrique: X7R
R27-R30 R33-R37 = res 240 1%: res 240 1% 0402
R31 R32 = res 10k 1%: res 10k 1% 0402
R38-R66 = res 49R9 1%: res 49R9 ohm 1% 0402
TB5 = Title bloc ANSI
U1 = IMX6Q5EYM10AE: 32-Bit i.MX 6 Quad Application Processor, 1 GHz, 256 KB RAM, Extended Consumer Grade, 624-Pin FCPBGA, RoHS, Tape and Reel; PartNumber: MCIMX6Q5EYM10ACR; Manufacturer: Freescale Semiconductor; CAN: FlexCAN; Number of Cores: 4 Spec; External Memory Supported: DDR3, DDR3L, FLASH, LPDDR2; Speed Grade: 1 GHz; Core Type: ARM Cortex A9; Cache (KB): 32; Ethernet: 1 Gbps + IEEE 1588; Internal RAM (KB): 256; ComponentLink1Description: Manufacturer URL; ComponentLink2Description: Datasheet; DatasheetVersion: Rev. 2.3; ComponentLink3URL: http://cache.freescale.com/files/32bit/doc/data_sheet/IMX6DQCEC.pdf?fpsp=1&WT_TYPE=Data%20Sheets&WT_VENDOR=FREESCALE&WT_FILE_FORMAT=pdf&WT_ASSET=Documentation; ComponentLink1URL: http://www.freescale.com/; Packing: Tape and Reel; Temperature Range: -20 to 105 degC; ComponentLink2URL: http://cache.freescale.com/files/32bit/doc/data_sheet/IMX6DQCEC.pdf?fpsp=1&WT_TYPE=Data%20Sheets&WT_VENDOR=FREESCALE&WT_FILE_FORMAT=pdf&WT_ASSET=Documentation; ComponentLink3Description: Package Specification; PackageVersion: Rev. A; RoHS: TRUE; Quad/Dual CPU: i.MX 6Quad; Mounting Technology: Surface Mount; PackageReference: FCPBGA-624; PackageDescription: 624-pin Ball Grid Array Package, Body 21 x 21mm, Pitch 0.8mm
U3-U6 = DDR3: DDR3 4Gbx4

## Sheet ethernet.SchDoc
size A3; SheetNumber: 8; SheetTotal: 21
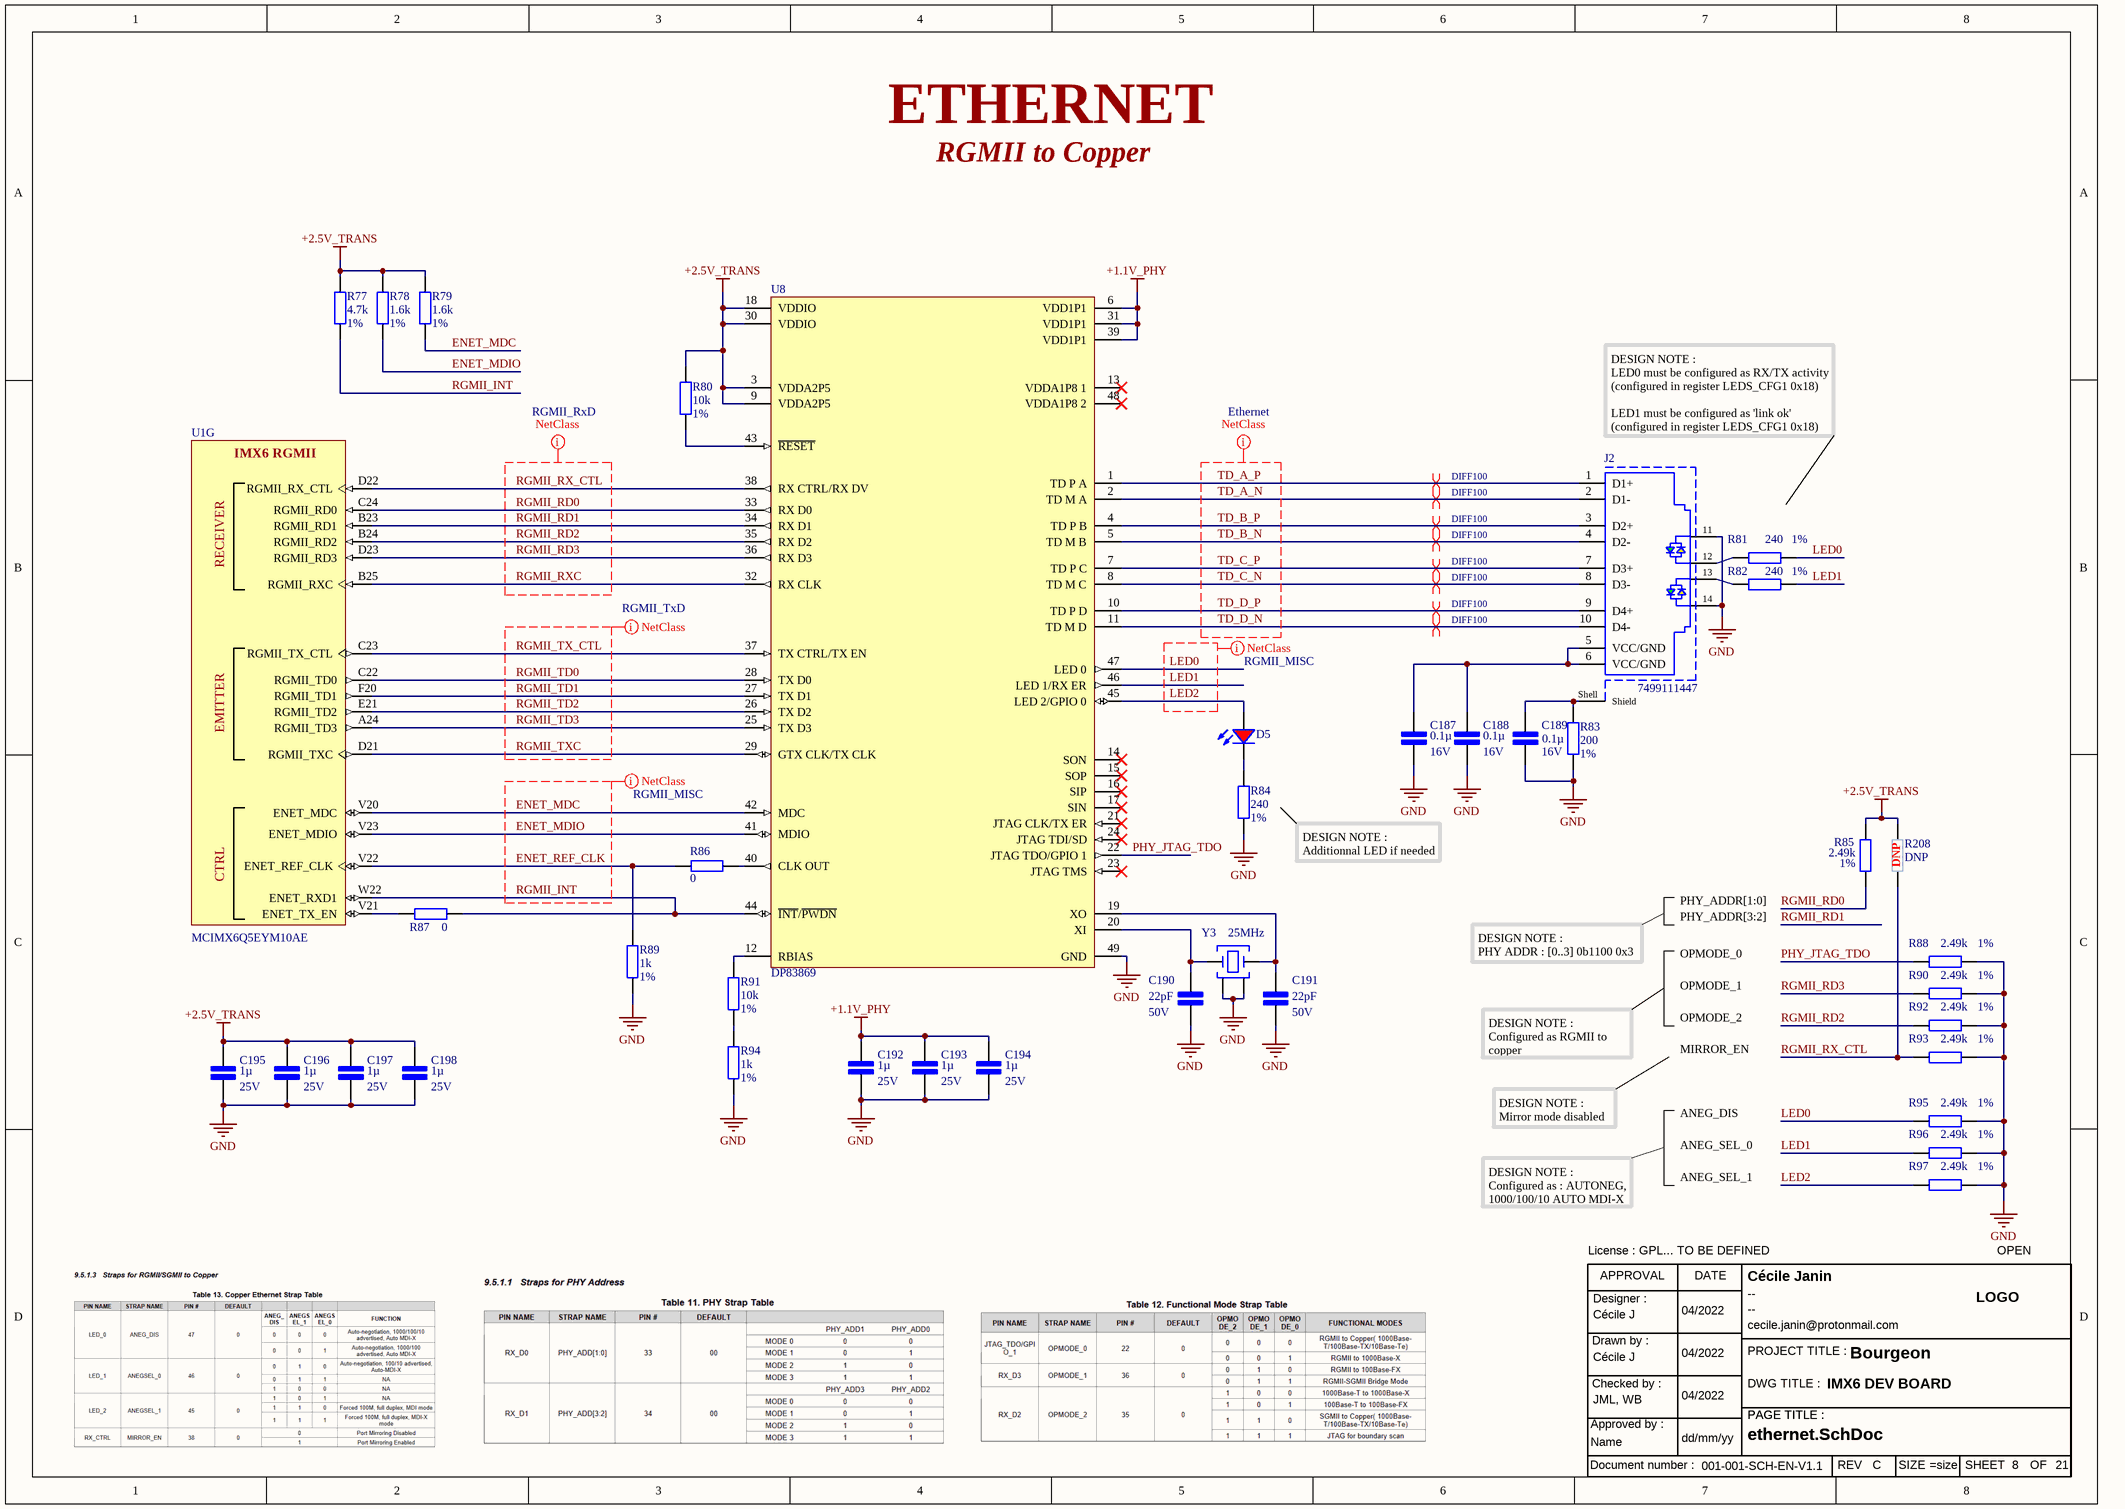
[diagram p10: ethernet.SchDoc]

### Parts
C187  0.1µ  Tension du diélectrique: 16V  [Cap cer 0402/1005]
C188  0.1µ  Tension du diélectrique: 16V  [Cap cer 0402/1005]
C189  0.1µ  Tension du diélectrique: 16V  [Cap cer 0402/1005]
C190  22pF  Tension du diélectrique: 50V  [Cap cer 0402/1005]
C191  22pF  Tension du diélectrique: 50V  [Cap cer 0402/1005]
C192  1µ  Tension du diélectrique: 25V  [Cap cer 0402/1005]
C193  1µ  Tension du diélectrique: 25V  [Cap cer 0402/1005]
C194  1µ  Tension du diélectrique: 25V  [Cap cer 0402/1005]
C195  1µ  Tension du diélectrique: 25V  [Cap cer 0402/1005]
C196  1µ  Tension du diélectrique: 25V  [Cap cer 0402/1005]
C197  1µ  Tension du diélectrique: 25V  [Cap cer 0402/1005]
C198  1µ  Tension du diélectrique: 25V  [Cap cer 0402/1005]
D5  Red, 2V, 120deg  [LED red 0603]  (value not drawn)
J2  7499111447  [RJ45 7499111447]
R77  4.7k  pourcentage: 1%  [Res 0402/1005]
R78  1.6k  pourcentage: 1%  [Res 0402/1005]
R79  1.6k  pourcentage: 1%  [Res 0402/1005]
R80  10k  pourcentage: 1%  [Res 0402/1005]
R81  240  pourcentage: 1%  [Res 0402/1005]
R82  240  pourcentage: 1%  [Res 0402/1005]
R83  200  pourcentage: 1%  [Res 0402/1005]
R84  240  pourcentage: 1%  [Res 0402/1005]
R85  2.49k  pourcentage: 1%  [Res 0402/1005]
R86  0  [Res 0402/1005]
R87  0  [Res 0402/1005]
R88  2.49k  pourcentage: 1%  [Res 0402/1005]
R89  1k  pourcentage: 1%  [Res 0402/1005]
R90  2.49k  pourcentage: 1%  [Res 0402/1005]
R91  10k  pourcentage: 1%  [Res 0402/1005]
R92  2.49k  pourcentage: 1%  [Res 0402/1005]
R93  2.49k  pourcentage: 1%  [Res 0402/1005]
R94  1k  pourcentage: 1%  [Res 0402/1005]
R95  2.49k  pourcentage: 1%  [Res 0402/1005]
R96  2.49k  pourcentage: 1%  [Res 0402/1005]
R97  2.49k  pourcentage: 1%  [Res 0402/1005]
R208  DNP  [Res 0402/1005]
TB7  Title bloc ANSI modified  (value not drawn)
U1  MCIMX6Q5EYM10AE  [FRES-2197-01]  (part G of 21)
U8  DP83869  [QFN48]
Y3  25MHz  [IQXC-42]

### Nets
+1.1V_PHY: C192.1 C193.1 C194.1 U8.6(VDD1P1) U8.31(VDD1P1) U8.39(VDD1P1)
+2.5V_TRANS: C195.1 C196.1 C197.1 C198.1 R77.2 R78.2 R79.2 R80.2 R85.2 R208.2 U8.3(VDDA2P5) U8.9(VDDA2P5) U8.18(VDDIO) U8.30(VDDIO)
GND: C187.2 C188.2 C189.2 C190.2 C191.2 C192.2 C193.2 C194.2 C195.2 C196.2 C197.2 C198.2 J2.11 J2.14 R83.1 R84.1 R88.1 R89.1 R90.1 R92.1 R93.1 R94.1 R95.1 R96.1 R97.1 U8.49(GND) Y3.2(GND) Y3.4(GND)
ENET_MDC: R79.1 U1.V20(ENET_MDC) U8.42(MDC)
ENET_MDIO: R78.1 U1.V23(ENET_MDIO) U8.41(MDIO)
ENET_REF_CLK: R86.1 R89.2 U1.V22(ENET_REF_CLK)
LED0: R81.2 R95.2 U8.47(LED_0)
LED1: R82.2 R96.2 U8.46(LED_1/RX_ER)
LED2: D5.2(A) R97.2 U8.45(LED_2/GPIO_0)
PHY_JTAG_TDO: R88.2 U8.22(JTAG_TDO/GPIO_1)
RGMII_INT: R77.1 R87.2 U1.W22(ENET_RXD1) U8.44(~{INT}/~{PWDN})
RGMII_RD0: R85.1 U1.C24(RGMII_RD0) U8.33(RX_D0)
RGMII_RD1: U1.B23(RGMII_RD1) U8.34(RX_D1)
RGMII_RD2: R92.2 U1.B24(RGMII_RD2) U8.35(RX_D2)
RGMII_RD3: R90.2 U1.D23(RGMII_RD3) U8.36(RX_D3)
RGMII_RX_CTL: R93.2 R208.1 U1.D22(RGMII_RX_CTL) U8.38(RX_CTRL/RX_DV)
RGMII_RXC: U1.B25(RGMII_RXC) U8.32(RX_CLK)
RGMII_TD0: U1.C22(RGMII_TD0) U8.28(TX_D0)
RGMII_TD1: U1.F20(RGMII_TD1) U8.27(TX_D1)
RGMII_TD2: U1.E21(RGMII_TD2) U8.26(TX_D2)
RGMII_TD3: U1.A24(RGMII_TD3) U8.25(TX_D3)
RGMII_TX_CTL: U1.C23(RGMII_TX_CTL) U8.37(TX_CTRL/TX_EN)
RGMII_TXC: U1.D21(RGMII_TXC) U8.29(GTX_CLK/TX_CLK)
TD_A_N: J2.2(D1-) U8.2(TD_M_A)
TD_A_P: J2.1(D1+) U8.1(TD_P_A)
TD_B_N: J2.4(D2-) U8.5(TD_M_B)
TD_B_P: J2.3(D2+) U8.4(TD_P_B)
TD_C_N: J2.8(D3-) U8.8(TD_M_C)
TD_C_P: J2.7(D3+) U8.7(TD_P_C)
TD_D_N: J2.10(D4-) U8.11(TD_M_D)
TD_D_P: J2.9(D4+) U8.10(TD_P_D)
NetC187_1: C187.1 C188.1 J2.5(VCC/GND) J2.6(VCC/GND)
NetC189_1: C189.1 J2.Shell(Shield) R83.2
NetC190_1: C190.1 U8.20(XI) Y3.1(Crystal)
NetC191_1: C191.1 U8.19(XO) Y3.3(Crystal)
NetD5_1: D5.1(K) R84.2
NetJ2_12: J2.12 R81.1
NetJ2_13: J2.13 R82.1
NetR80_1: R80.1 U8.43(~{RESET})
NetR86_2: R86.2 U8.40(CLK_OUT)
NetR87_1: R87.1 U1.V21(ENET_TX_EN)
NetR91_1: R91.1 R94.2
NetR91_2: R91.2 U8.12(RBIAS)

Not connected (* = marked no-connect by the designer): U8 13(VDDA1P8_1)* 14(SON)* 15(SOP)* 16(SIP)* 17(SIN)* 21(JTAG_CLK/TX_ER)* 23(JTAG_TMS)* 24(JTAG_TDI/SD)* 48(VDDA1P8_2)*

### Layout directives
net class Ethernet: TD_A_N, TD_A_P, TD_B_N, TD_B_P, TD_C_N, TD_C_P, TD_D_N, TD_D_P
net class RGMII_RxD: RGMII_RD0, RGMII_RD1, RGMII_RD2, RGMII_RD3, RGMII_RX_CTL, RGMII_RXC
differential pair; differential pair class DIFF100: TD_A_N, TD_A_P, TD_B_N, TD_B_P, TD_C_N, TD_C_P, TD_D_N, TD_D_P
net class RGMII_TxD: RGMII_TD0, RGMII_TD1, RGMII_TD2, RGMII_TD3, RGMII_TX_CTL, RGMII_TXC
net class RGMII_MISC: ENET_MDC, ENET_MDIO, ENET_REF_CLK, LED0, LED1, LED2, RGMII_INT

### Notes on the sheet
- ETHERNET
- RGMII to Copper
- (near J2) DESIGN NOTE :
  LED0 must be configured as RX/TX activity (configured in register LEDS_CFG1 0x18)
  LED1 must be configured as 'link ok' (configured in register LEDS_CFG1 0x18)
- DESIGN NOTE :
  Additionnal LED if needed
- PHY_ADDR[1:0]
- PHY_ADDR[3:2]
- DESIGN NOTE :
  PHY ADDR : [0..3] 0b1100 0x3
- OPMODE_0
- OPMODE_1
- DESIGN NOTE :
  Configured as RGMII to copper
- OPMODE_2
- MIRROR_EN
- DESIGN NOTE :
  Mirror mode disabled
- ANEG_DIS
- ANEG_SEL_0
- ANEG_SEL_1
- DESIGN NOTE :
  Configured as : AUTONEG, 1000/100/10 AUTO MDI-X
- (in symbol IMX6Q5EYM10AE, part G) IMX6 RGMII; RECEIVER; EMITTER; CTRL
- (in symbol Title bloc ANSI) APPROVAL; DATE; Designer :; LOGO; Drawn by :; PROJECT TITLE :; Checked by :; DWG TITLE :; PAGE TITLE :; Approved by :; Document number :; REV; SIZE; SHEET; OF

### Library data of the parts
C187-C189 = cap 0.1µ 16V: as C149 on sheet dram
C190 C191 = cap 22pF 50V: cap cer 22pF 50V 5% NP0 0402; Diélectrique: NP0
C192-C198 = cap 1µ 25V: cap cer 1µ 25V 10% X5R 0402; Diélectrique: X5R
D5 = LED Red 0603: WL-SMCC SMD Mono-color Chip LED Compact, size 0603, Red, 2V, 120deg 150060RS73220; Dominant Wavelength: 624nm; Luminous Intensity: 90mcd; Peak Wavelength: 632nm; Chip Technology: AlInGaP; ComponentLink1URL: http://www.we-online.de; ComponentLink2Description: Datasheet; ComponentLink2URL: https://katalog.we-online.com/led/datasheet/150060RS73220.pdf; Part Number: 150060RS73220; Published Date: July 2019; Publisher: Wurth Elektronik; Size: 0603; Viewing Angle: 120deg; Packaging: Tape and Reel; Emitting Color: Red; Mounting Technology: SMT; Forward Voltage: 2V; Operating Temperature: -40 to +85degC
J2 = RJ45 7499111447
R77 = res 4.7k 1%: res 4.7k 1% 0402
R78 R79 = res 1.6k 1%: res 1.6k 1% 0402
R80 R91 = res 10k 1%: res 10k 1% 0402
R81 R82 R84 = res 240 1%: res 240 1% 0402
R83 = res 200 1%: res 200 1% 0402
R85 R88 R90 R92 R93 R95-R97 = res 2.49k 1%: res 2.49k 1% 0402
R86 R87 = res 0Ohm small: res 0402; pourcentage: --
R89 R94 = res 1k 1%: res 1k 1% 0402
R208 = res DNP 0402: res DNP 0403; pourcentage: 1%
TB7 = Title bloc ANSI
U1 = IMX6Q5EYM10AE: as U1 on sheet dram; ComponentLink1Description: Manufacturer URL; ComponentLink2Description: Datasheet; DatasheetVersion: Rev. 2.3; ComponentLink3URL: http://cache.freescale.com/files/32bit/doc/data_sheet/IMX6DQCEC.pdf?fpsp=1&WT_TYPE=Data%20Sheets&WT_VENDOR=FREESCALE&WT_FILE_FORMAT=pdf&WT_ASSET=Documentation; ComponentLink1URL: http://www.freescale.com/; Packing: Tape and Reel; Temperature Range: -20 to 105 degC; ComponentLink2URL: http://cache.freescale.com/files/32bit/doc/data_sheet/IMX6DQCEC.pdf?fpsp=1&WT_TYPE=Data%20Sheets&WT_VENDOR=FREESCALE&WT_FILE_FORMAT=pdf&WT_ASSET=Documentation; ComponentLink3Description: Package Specification; PackageVersion: Rev. A; RoHS: TRUE; Quad/Dual CPU: i.MX 6Quad; Mounting Technology: Surface Mount; PackageReference: FCPBGA-624; PackageDescription: 624-pin Ball Grid Array Package, Body 21 x 21mm, Pitch 0.8mm
U8 = IC DP83869: Ethernet transciever
Y3 = XTAL 25MHz: WE-XTAL, 25MHz, +/-10ppm; Manufacturer Part Number: 830108212509; Manufacturer: Wurth Elektronik; Frequency: 24MHz; Load Capacitance: 10pF; Operating Temperature: -20 to +70degC; Packaging: Tape and Reel; Published Date: July 2020; Frequency Stability: +/-10ppm; Frequency Tolerance: +/-10ppm; Mounting Technology: SMT

## Sheet sd_flash_eeprom.SchDoc
size A4; SheetNumber: 9; SheetTotal: 21
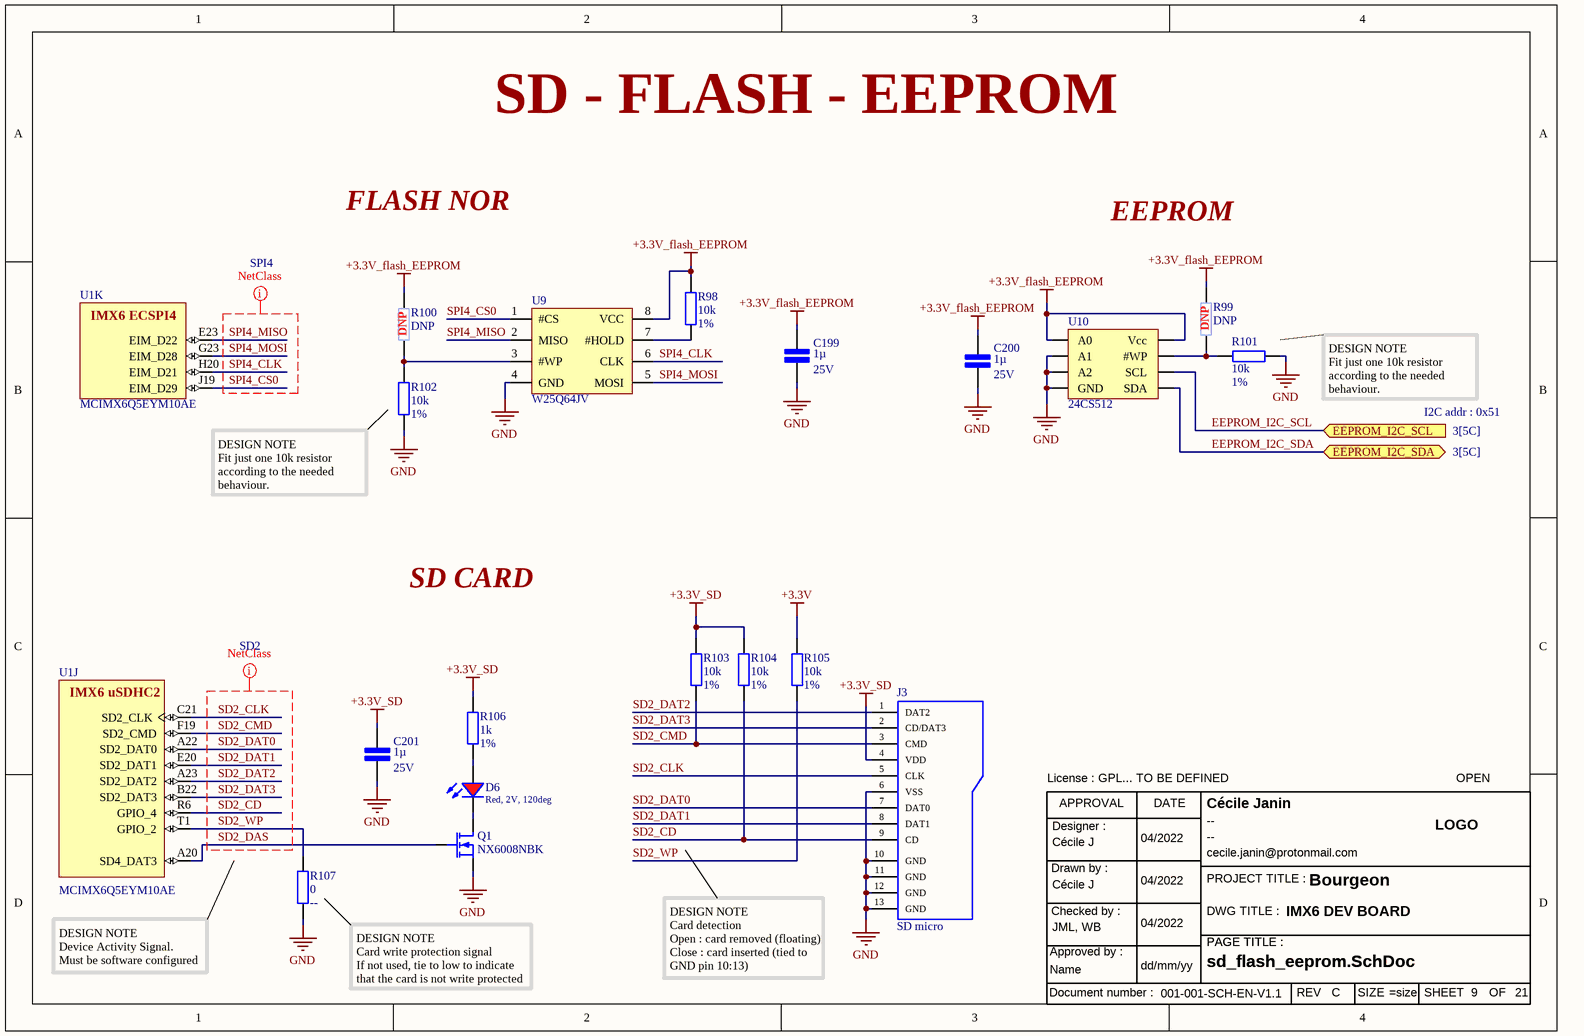
[diagram p11: sd_flash_eeprom.SchDoc]

### Parts
C199  1µ  Tension du diélectrique: 25V  [Cap cer 0402/1005]
C200  1µ  Tension du diélectrique: 25V  [Cap cer 0402/1005]
C201  1µ  Tension du diélectrique: 25V  [Cap cer 0402/1005]
D6  Red, 2V, 120deg  [LED red 0603]
J3  SD micro  [SD_micro_693071020811]
Q1  NX6008NBK  [Sot-23-3 mosfet]
R98  10k  pourcentage: 1%  [Res 0402/1005]
R99  DNP  [Res 0402/1005]
R100  DNP  [Res 0402/1005]
R101  10k  pourcentage: 1%  [Res 0402/1005]
R102  10k  pourcentage: 1%  [Res 0402/1005]
R103  10k  pourcentage: 1%  [Res 0402/1005]
R104  10k  pourcentage: 1%  [Res 0402/1005]
R105  10k  pourcentage: 1%  [Res 0402/1005]
R106  1k  pourcentage: 1%  [Res 0402/1005]
R107  0  [Res 0603/1603]
TB8  Title bloc ANSI modified  (value not drawn)
U1  MCIMX6Q5EYM10AE  [FRES-2197-01]  (parts J,K of 21)
U9  W25Q64JV  [SOIC 8 pin FLSH (longer)]
U10  24CS512  [soic-8]

### Ports
EEPROM_I2C_SCL (in, see 3[5C]), EEPROM_I2C_SDA (bidir, see 3[5C])

### Nets
+3.3V: R105.2
+3.3V_flash_EEPROM: C199.1 C200.1 R98.2 R99.2 R100.2 U9.8(VCC) U10.1(A0) U10.8(Vcc)
+3.3V_SD: C201.1 J3.4(VDD) R103.2 R104.2 R106.2
GND: C199.2 C200.2 C201.2 J3.6(VSS) J3.10(GND) J3.11(GND) J3.12(GND) J3.13(GND) Q1.S R101.1 R102.1 R107.1 U9.4(GND) U10.2(A1) U10.3(A2) U10.4(GND)
EEPROM_I2C_SCL: U10.6(SCL) ; port EEPROM_I2C_SCL
EEPROM_I2C_SDA: U10.5(SDA) ; port EEPROM_I2C_SDA
SD2_CD: J3.9(CD) R104.1 U1.R6(GPIO_4)
SD2_CLK: J3.5(CLK) U1.C21(SD2_CLK)
SD2_CMD: J3.3(CMD) R103.1 U1.F19(SD2_CMD)
SD2_DAS: Q1.G U1.A20(SD4_DAT3)
SD2_DAT0: J3.7(DAT0) U1.A22(SD2_DAT0)
SD2_DAT1: J3.8(DAT1) U1.E20(SD2_DAT1)
SD2_DAT2: J3.1(DAT2) U1.A23(SD2_DAT2)
SD2_DAT3: J3.2(CD/DAT3) U1.B22(SD2_DAT3)
SD2_WP: R105.1 R107.2 U1.T1(GPIO_2)
SPI4_CLK: U1.H20(EIM_D21) U9.6(CLK)
SPI4_CS0: U1.J19(EIM_D29) U9.1(#CS)
SPI4_MISO: U1.E23(EIM_D22) U9.2(MISO)
SPI4_MOSI: U1.G23(EIM_D28) U9.5(MOSI)
NetD6_1: D6.1(K) Q1.D
NetD6_2: D6.2(A) R106.1
NetR98_1: R98.1 U9.7(#HOLD)
NetR99_1: R99.1 R101.2 U10.7(#WP)
NetR100_1: R100.1 R102.2 U9.3(#WP)

### Layout directives
net class SPI4: SPI4_CLK, SPI4_CS0, SPI4_MISO, SPI4_MOSI
net class SD2: SD2_CD, SD2_CLK, SD2_CMD, SD2_DAS, SD2_DAT0, SD2_DAT1, SD2_DAT2, SD2_DAT3, SD2_WP

### Notes on the sheet
- SD - FLASH - EEPROM
- FLASH NOR
- EEPROM
- DESIGN NOTE
  Fit just one 10k resistor according to the needed behaviour.
  Pull down by default
- I2C addr : 0x51
- SD CARD
- DESIGN NOTE
  Device Activity Signal.
  Must be software configured
- DESIGN NOTE
  Card write protection signal
  If not used, tie to low to indicate that the card is not write protected
- DESIGN NOTE
  Card detection
  Open : card removed (floating)
  Close : card inserted (tied to GND pin 10:13)
- (in symbol IMX6Q5EYM10AE, part J) IMX6 uSDHC2
- (in symbol IMX6Q5EYM10AE, part K) IMX6 ECSPI4
- (in symbol Title bloc ANSI) APPROVAL; DATE; Designer :; LOGO; Drawn by :; PROJECT TITLE :; Checked by :; DWG TITLE :; PAGE TITLE :; Approved by :; Document number :; REV; SIZE; SHEET; OF

### Library data of the parts
C199-C201 = cap 1µ 25V: cap cer 1µ 25V 10% X5R 0402; Diélectrique: X5R
D6 = LED Red 0603: as D5 on sheet ethernet; ComponentLink1URL: http://www.we-online.de; ComponentLink2Description: Datasheet; ComponentLink2URL: https://katalog.we-online.com/led/datasheet/150060RS73220.pdf; Part Number: 150060RS73220; Published Date: July 2019; Publisher: Wurth Elektronik; Size: 0603; Viewing Angle: 120deg; Packaging: Tape and Reel; Emitting Color: Red; Mounting Technology: SMT; Forward Voltage: 2V; Operating Temperature: -40 to +85degC
J3 = SD_micro_693071020811: SD micro card, push & push
Q1 = Tr nmos NX6008NBK: SOT-23-3 270mA 60V ESD protected 2kV HBM
R98 R101-R105 = res 10k 1%: res 10k 1% 0402
R99 R100 = res DNP 0402: res DNP 0403; pourcentage: 1%
R106 = res 1k 1%: res 1k 1% 0402
R107 = res 0Ohm: res 0603; pourcentage: --
TB8 = Title bloc ANSI
U1 = IMX6Q5EYM10AE: as U1 on sheet dram; ComponentLink1Description: Manufacturer URL; ComponentLink2Description: Datasheet; DatasheetVersion: Rev. 2.3; ComponentLink3URL: http://cache.freescale.com/files/32bit/doc/data_sheet/IMX6DQCEC.pdf?fpsp=1&WT_TYPE=Data%20Sheets&WT_VENDOR=FREESCALE&WT_FILE_FORMAT=pdf&WT_ASSET=Documentation; ComponentLink1URL: http://www.freescale.com/; Packing: Tape and Reel; Temperature Range: -20 to 105 degC; ComponentLink2URL: http://cache.freescale.com/files/32bit/doc/data_sheet/IMX6DQCEC.pdf?fpsp=1&WT_TYPE=Data%20Sheets&WT_VENDOR=FREESCALE&WT_FILE_FORMAT=pdf&WT_ASSET=Documentation; ComponentLink3Description: Package Specification; PackageVersion: Rev. A; RoHS: TRUE; Quad/Dual CPU: i.MX 6Quad; Mounting Technology: Surface Mount; PackageReference: FCPBGA-624; PackageDescription: 624-pin Ball Grid Array Package, Body 21 x 21mm, Pitch 0.8mm
U9 = IC W25Q64JV: 64Mbit flash NOR
U10 = IC 24CS512: EEPROM 512kbit

## Sheet gpio.SchDoc
size A4; SheetNumber: 10; SheetTotal: 21
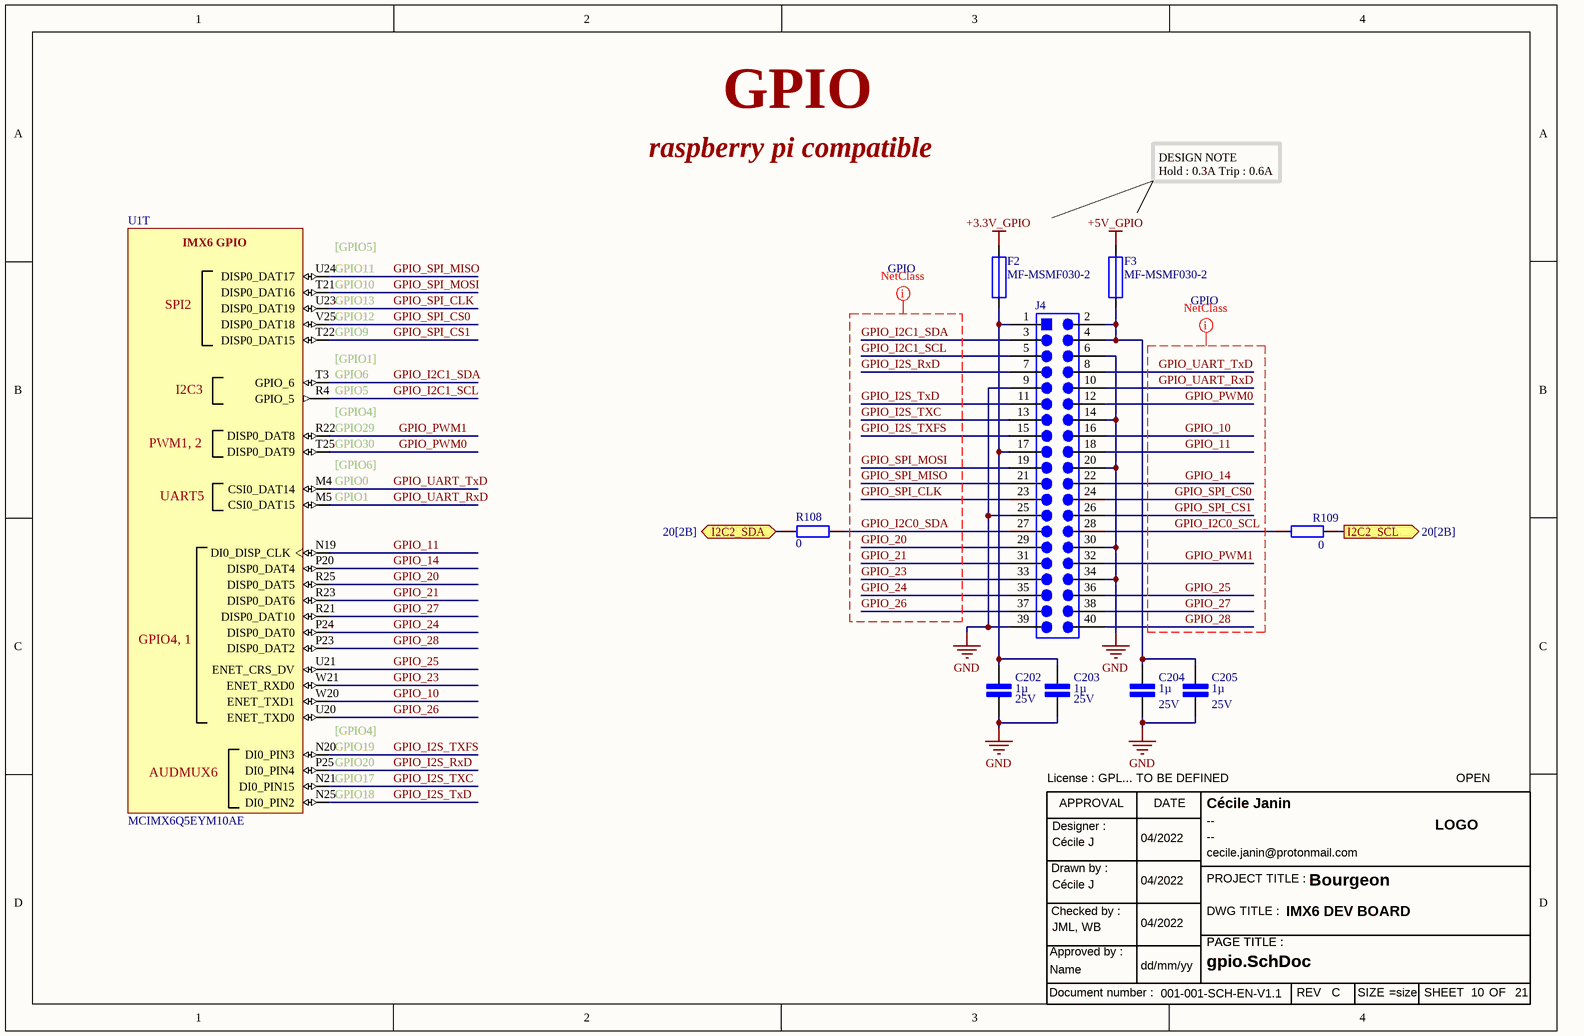
[diagram p12: gpio.SchDoc]

### Parts
C202  1µ  Tension du diélectrique: 25V  [Cap cer 0402/1005]
C203  1µ  Tension du diélectrique: 25V  [Cap cer 0402/1005]
C204  1µ  Tension du diélectrique: 25V  [Cap cer 0402/1005]
C205  1µ  Tension du diélectrique: 25V  [Cap cer 0402/1005]
F2  MF-MSMF030-2  [Fuse 1812/4532 MF-MSMF050-2]
F3  MF-MSMF030-2  [Fuse 1812/4532 MF-MSMF050-2]
J4  header_rasppi_61304021121  [header_rasppi_61304021121]  (value not drawn)
R108  0  [Res 0603/1603]
R109  0  [Res 0603/1603]
TB9  Title bloc ANSI modified  (value not drawn)
U1  MCIMX6Q5EYM10AE  [FRES-2197-01]  (part T of 21)

### Ports
I2C2_SCL (out, see 20[2B]), I2C2_SDA (bidir, see 20[2B])

### Nets
+3.3V_GPIO: F2.2
+5V_GPIO: F3.2
GND: C202.2 C203.2 C204.2 C205.2 J4.6 J4.9 J4.14 J4.20 J4.25 J4.30 J4.34 J4.39
CdE_I2C_SCL: R109.2 ; port I2C2_SCL
CdE_I2C_SDA: R108.1 ; port I2C2_SDA
GPIO_10: J4.16 U1.W20(ENET_TXD1)
GPIO_11: J4.18 U1.N19(DI0_DISP_CLK)
GPIO_14: J4.22 U1.P20(DISP0_DAT4)
GPIO_20: J4.29 U1.R25(DISP0_DAT5)
GPIO_21: J4.31 U1.R23(DISP0_DAT6)
GPIO_23: J4.33 U1.W21(ENET_RXD0)
GPIO_24: J4.35 U1.P24(DISP0_DAT0)
GPIO_25: J4.36 U1.U21(ENET_CRS_DV)
GPIO_26: J4.37 U1.U20(ENET_TXD0)
GPIO_27: J4.38 U1.R21(DISP0_DAT10)
GPIO_28: J4.40 U1.P23(DISP0_DAT2)
GPIO_I2C0_SCL: J4.28 R109.1
GPIO_I2C0_SDA: J4.27 R108.2
GPIO_I2C1_SCL: J4.5 U1.R4(GPIO_5)
GPIO_I2C1_SDA: J4.3 U1.T3(GPIO_6)
GPIO_I2S_RxD: J4.7 U1.P25(DI0_PIN4)
GPIO_I2S_TXC: J4.13 U1.N21(DI0_PIN15)
GPIO_I2S_TxD: J4.11 U1.N25(DI0_PIN2)
GPIO_I2S_TXFS: J4.15 U1.N20(DI0_PIN3)
GPIO_PWM0: J4.12 U1.T25(DISP0_DAT9)
GPIO_PWM1: J4.32 U1.R22(DISP0_DAT8)
GPIO_SPI_CLK: J4.23 U1.U23(DISP0_DAT19)
GPIO_SPI_CS0: J4.24 U1.V25(DISP0_DAT18)
GPIO_SPI_CS1: J4.26 U1.T22(DISP0_DAT15)
GPIO_SPI_MISO: J4.21 U1.U24(DISP0_DAT17)
GPIO_SPI_MOSI: J4.19 U1.T21(DISP0_DAT16)
GPIO_UART_RxD: J4.10 U1.M5(CSI0_DAT15)
GPIO_UART_TxD: J4.8 U1.M4(CSI0_DAT14)
NetC202_1: C202.1 C203.1 F2.1 J4.1 J4.17
NetC204_1: C204.1 C205.1 F3.1 J4.2 J4.4

### Layout directives
net class GPIO: GPIO_10, GPIO_11, GPIO_14, GPIO_20, GPIO_21, GPIO_23, GPIO_24, GPIO_25, GPIO_26, GPIO_27, GPIO_28, GPIO_I2C0_SCL, GPIO_I2C0_SDA, GPIO_I2C1_SCL, GPIO_I2C1_SDA, GPIO_I2S_RxD, GPIO_I2S_TXC, GPIO_I2S_TxD, GPIO_I2S_TXFS, GPIO_PWM0, GPIO_PWM1, GPIO_SPI_CLK, GPIO_SPI_CS0, GPIO_SPI_CS1, GPIO_SPI_MISO, GPIO_SPI_MOSI, GPIO_UART_RxD, GPIO_UART_TxD

### Notes on the sheet
- raspberry pi compatible
- GPIO
- DESIGN NOTE
  Hold : 0.3A Trip : 0.6A
- (near U1) GPIO11
- (near U1) [GPIO5]
- (near U1) GPIO10
- (near U1) GPIO13
- (near U1) GPIO12
- (near U1) GPIO9
- (near U1) GPIO6
- (near U1) [GPIO1]
- (near U1) GPIO5
- (near U1) GPIO29
- (near U1) GPIO30
- (near U1) [GPIO4]
- (near U1) GPIO0
- (near U1) GPIO1
- (near U1) [GPIO6]
- (near U1) GPIO19
- (near U1) GPIO20
- (near U1) GPIO17
- (near U1) GPIO18
- (in symbol IMX6Q5EYM10AE, part T) IMX6 GPIO; SPI2; I2C3; PWM1, 2; UART5; GPIO4, 1; AUDMUX6
- (in symbol Title bloc ANSI) APPROVAL; DATE; Designer :; LOGO; Drawn by :; PROJECT TITLE :; Checked by :; DWG TITLE :; PAGE TITLE :; Approved by :; Document number :; REV; SIZE; SHEET; OF

### Library data of the parts
C202-C205 = cap 1µ 25V: cap cer 1µ 25V 10% X5R 0402; Diélectrique: X5R
F2 F3 = Fuse PPTC 0.3A: Hold : 0.3A, trip 0.6A 30V 1812
J4 = header_rasppi_61304021121: header raspberry pi compatible
R108 R109 = res 0Ohm: res 0603; pourcentage: --
TB9 = Title bloc ANSI
U1 = IMX6Q5EYM10AE: as U1 on sheet dram; ComponentLink1Description: Manufacturer URL; ComponentLink2Description: Datasheet; DatasheetVersion: Rev. 2.3; ComponentLink3URL: http://cache.freescale.com/files/32bit/doc/data_sheet/IMX6DQCEC.pdf?fpsp=1&WT_TYPE=Data%20Sheets&WT_VENDOR=FREESCALE&WT_FILE_FORMAT=pdf&WT_ASSET=Documentation; ComponentLink1URL: http://www.freescale.com/; Packing: Tape and Reel; Temperature Range: -20 to 105 degC; ComponentLink2URL: http://cache.freescale.com/files/32bit/doc/data_sheet/IMX6DQCEC.pdf?fpsp=1&WT_TYPE=Data%20Sheets&WT_VENDOR=FREESCALE&WT_FILE_FORMAT=pdf&WT_ASSET=Documentation; ComponentLink3Description: Package Specification; PackageVersion: Rev. A; RoHS: TRUE; Quad/Dual CPU: i.MX 6Quad; Mounting Technology: Surface Mount; PackageReference: FCPBGA-624; PackageDescription: 624-pin Ball Grid Array Package, Body 21 x 21mm, Pitch 0.8mm

## Sheet hdmi.SchDoc
size A4; SheetNumber: 11; SheetTotal: 21
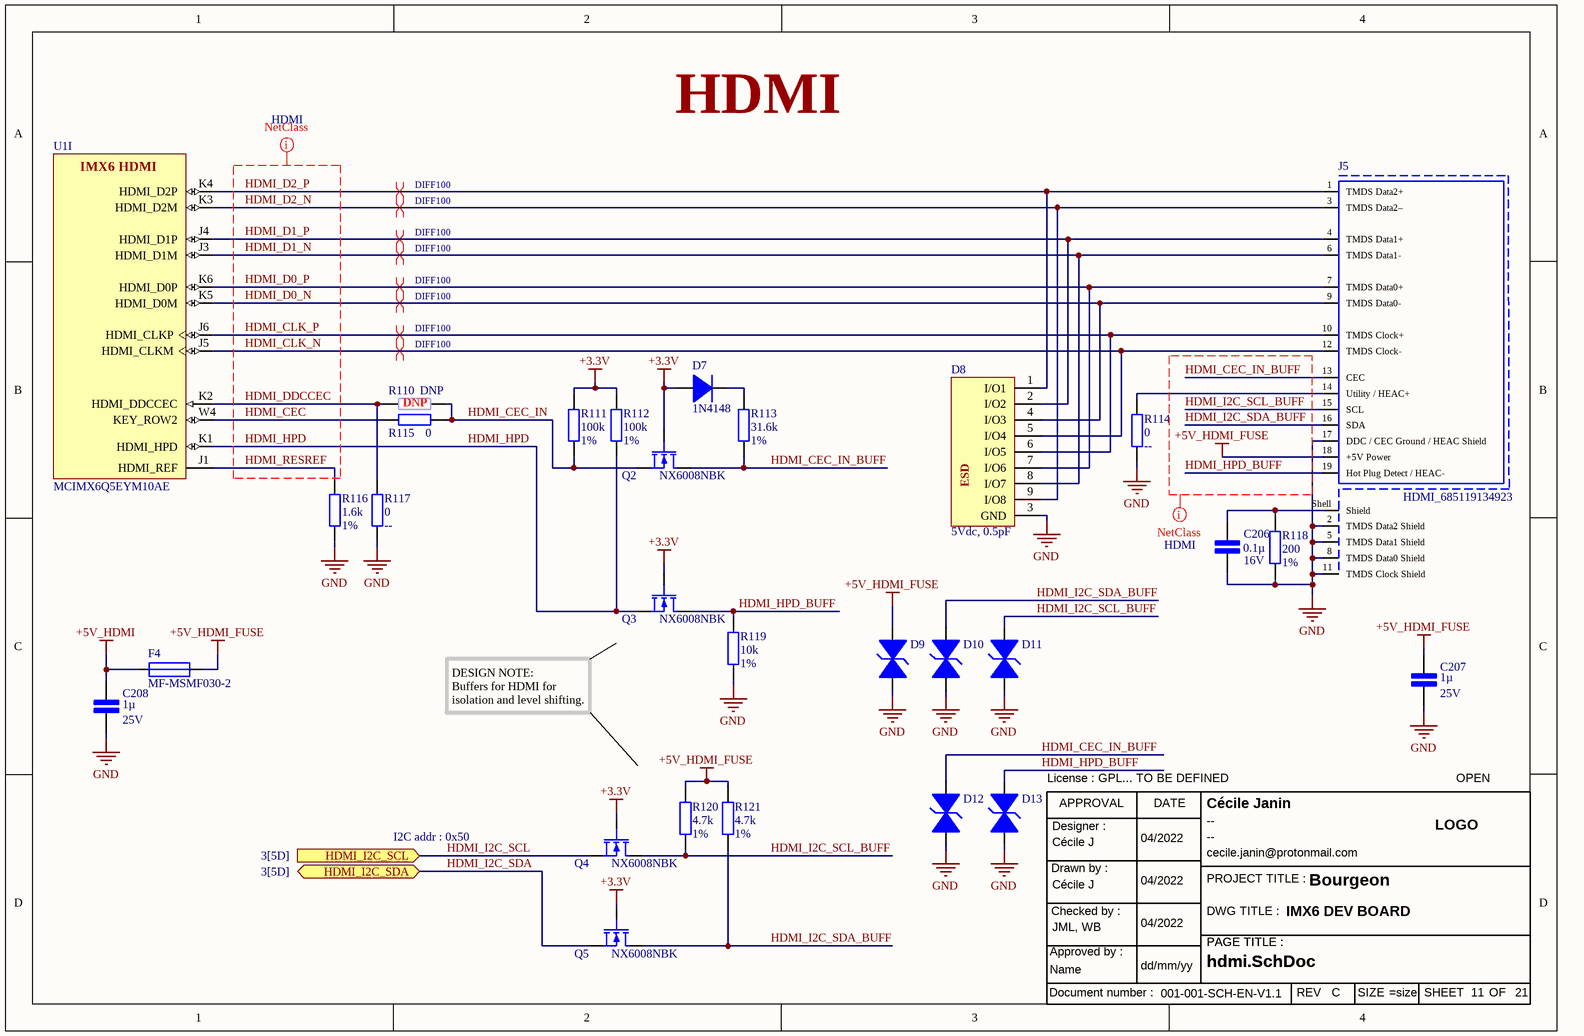
[diagram p13: hdmi.SchDoc]

### Parts
C206  0.1µ  Tension du diélectrique: 16V  [Cap cer 0402/1005]
C207  1µ  Tension du diélectrique: 25V  [Cap cer 0402/1005]
C208  1µ  Tension du diélectrique: 25V  [Cap cer 0402/1005]
D7  1N4148  [diode SOD-123]
D8  5Vdc, 0.5pF  [TVS 8 pin]
D9  TVS 5V  [inductor 0402/1005]  (value not drawn)
D10  TVS 5V  [inductor 0402/1005]  (value not drawn)
D11  TVS 5V  [inductor 0402/1005]  (value not drawn)
D12  TVS 5V  [inductor 0402/1005]  (value not drawn)
D13  TVS 5V  [inductor 0402/1005]  (value not drawn)
F4  MF-MSMF030-2  [Fuse 1812/4532 MF-MSMF050-2]
J5  HDMI_685119134923  [HDMI_685119134923]
Q2  NX6008NBK  [Sot-23-3 mosfet]
Q3  NX6008NBK  [Sot-23-3 mosfet]
Q4  NX6008NBK  [Sot-23-3 mosfet]
Q5  NX6008NBK  [Sot-23-3 mosfet]
R110  DNP  [Res 0603/1603]
R111  100k  pourcentage: 1%  [Res 0402/1005]
R112  100k  pourcentage: 1%  [Res 0402/1005]
R113  31.6k  pourcentage: 1%  [Res 0402/1005]
R114  0  [Res 0402/1005]
R115  0  [Res 0603/1603]
R116  1.6k  pourcentage: 1%  [Res 0402/1005]
R117  0  [Res 0603/1603]
R118  200  pourcentage: 1%  [Res 0402/1005]
R119  10k  pourcentage: 1%  [Res 0402/1005]
R120  4.7k  pourcentage: 1%  [Res 0402/1005]
R121  4.7k  pourcentage: 1%  [Res 0402/1005]
TB10  Title bloc ANSI modified  (value not drawn)
U1  MCIMX6Q5EYM10AE  [FRES-2197-01]  (part I of 21)

### Ports
HDMI_I2C_SCL (in, see 3[5D]), HDMI_I2C_SDA (bidir, see 3[5D])

### Nets
+3.3V: D7.A Q2.G Q3.G Q4.G Q5.G R111.2 R112.2
+5V_HDMI: C208.1 F4.1
+5V_HDMI_FUSE: C207.1 D9.1 F4.2 J5.18(+5V_Power) R120.2 R121.2
GND: C206.2 C207.2 C208.2 D8.3(GND) D9.2 D10.2 D11.2 D12.2 D13.2 J5.2(TMDS_Data2_Shield) J5.5(TMDS_Data1_Shield) J5.8(TMDS_Data0_Shield) J5.11(TMDS_Clock_Shield) J5.17(DDC_/_CEC_Ground_/_HEAC_Shield) R114.1 R116.1 R117.1 R118.1 R119.1
HDMI_CEC: R115.1 U1.W4(KEY_ROW2)
HDMI_CEC_IN: Q2.S R110.2 R111.1 R115.2
HDMI_CEC_IN_BUFF: D12.1 J5.13(CEC) Q2.D R113.1
HDMI_CLK_N: D8.5(I/O4) J5.12(TMDS_Clock-) U1.J5(HDMI_CLKM)
HDMI_CLK_P: D8.6(I/O5) J5.10(TMDS_Clock+) U1.J6(HDMI_CLKP)
HDMI_D0_N: D8.4(I/O3) J5.9(TMDS_Data0-) U1.K5(HDMI_D0M)
HDMI_D0_P: D8.7(I/O6) J5.7(TMDS_Data0+) U1.K6(HDMI_D0P)
HDMI_D1_N: D8.8(I/O7) J5.6(TMDS_Data1-) U1.J3(HDMI_D1M)
HDMI_D1_P: D8.2(I/O2) J5.4(TMDS_Data1+) U1.J4(HDMI_D1P)
HDMI_D2_N: D8.9(I/O8) J5.3(TMDS_Data2–) U1.K3(HDMI_D2M)
HDMI_D2_P: D8.1(I/O1) J5.1(TMDS_Data2+) U1.K4(HDMI_D2P)
HDMI_DDCCEC: R110.1 R117.2 U1.K2(HDMI_DDCCEC)
HDMI_HPD: Q3.S R112.1 U1.K1(HDMI_HPD)
HDMI_HPD_BUFF: D13.1 J5.19(Hot_Plug_Detect_/_HEAC-) Q3.D R119.2
HDMI_I2C_SCL: Q4.S ; port HDMI_I2C_SCL
HDMI_I2C_SCL_BUFF: D11.1 J5.15(SCL) Q4.D R120.1
HDMI_I2C_SDA: Q5.S ; port HDMI_I2C_SDA
HDMI_I2C_SDA_BUFF: D10.1 J5.16(SDA) Q5.D R121.1
HDMI_RESREF: R116.2 U1.J1(HDMI_REF)
NetC206_1: C206.1 J5.Shell(Shield) R118.2
NetD7_K: D7.K R113.2
NetJ5_14: J5.14(Utility_/_HEAC+) R114.2

### Layout directives
net class HDMI: +5V_HDMI_FUSE, HDMI_CEC, HDMI_CEC_IN_BUFF, HDMI_CLK_N, HDMI_CLK_P, HDMI_D0_N, HDMI_D0_P, HDMI_D1_N, HDMI_D1_P, HDMI_D2_N, HDMI_D2_P, HDMI_DDCCEC, HDMI_HPD, HDMI_HPD_BUFF, HDMI_I2C_SCL_BUFF, HDMI_I2C_SDA_BUFF, HDMI_RESREF
differential pair; differential pair class DIFF100: HDMI_CLK_N, HDMI_CLK_P, HDMI_D0_N, HDMI_D0_P, HDMI_D1_N, HDMI_D1_P, HDMI_D2_N, HDMI_D2_P

### Notes on the sheet
- HDMI
- DESIGN NOTE:
  Buffers for HDMI for isolation and level shifting.
- I2C addr : 0x50
- (in symbol IMX6Q5EYM10AE, part I) IMX6 HDMI
- (in symbol Title bloc ANSI) APPROVAL; DATE; Designer :; LOGO; Drawn by :; PROJECT TITLE :; Checked by :; DWG TITLE :; PAGE TITLE :; Approved by :; Document number :; REV; SIZE; SHEET; OF
- (in symbol TVS HDMI) ESD

### Library data of the parts
C206 = cap 0.1µ 16V: as C149 on sheet dram
C207 C208 = cap 1µ 25V: cap cer 1µ 25V 10% X5R 0402; Diélectrique: X5R
D7 = Diode 1N4148 100V 150mA
D8 = TVS HDMI: WE-TVS TVS Diode – Super Speed Series, DFN3810-9L, 8 Channel, 5Vdc, 0.5pF 824014885; Manufacturer: Wurth Elektronik; Reverse Peak Pulse Current: 5A; Channel ESD Clamping Voltage: 10.5V; Channel Number: 8; Channel Operating Voltage: 5V; Channel Reverse Leakage Current: 1uA; ESD Air Discharge Capability: 15kV; Polarity: Unidirectional; Reverse Breakdown Voltage: 6V; ComponentLink1Description: Manufacturer Link; ComponentLink1URL: http://www.we-online.de; ComponentLink2Description: Datasheet; ComponentLink2URL: https://www.we-online.com/catalog/datasheet/824014885.pdf; Manufacturer Part Number: 824014885; Size: DFN3810-9L; Mounting Technology: SMT; Packaging: Tape and Reel; Channel Input Capacitance: 0.5pF; ESD Contact Discharge Capability: 15kV; Height: 0.5mm; Length: 3.8mm; Operating Temperature max.: 85C; Operating Temperature min.: -55C; Width: 1mm
D9-D13 = TVS suppressor 82357120050: 82357120050; ComponentLink1Description: New link; ComponentLink1URL: https://www.we-online.com/catalog/datasheet/82357120050.pdf
F4 = Fuse PPTC 0.3A: Hold : 0.3A, trip 0.6A 30V 1812
Q2-Q5 = Tr nmos NX6008NBK: SOT-23-3 270mA 60V ESD protected 2kV HBM
R110 = res DNP 0603: pourcentage: 1%
R111 R112 = res 100k 1%: res 100k 1% 0402
R113 = res 31.6k 1%: res 31.6k 1% 0402
R114 = res 0Ohm small: res 0402; pourcentage: --
R115 R117 = res 0Ohm: res 0603; pourcentage: --
R116 = res 1.6k 1%: res 1.6k 1% 0402
R118 = res 200 1%: res 200 1% 0402
R119 = res 10k 1%: res 10k 1% 0402
R120 R121 = res 4.7k 1%: res 4.7k 1% 0402
TB10 = Title bloc ANSI
U1 = IMX6Q5EYM10AE: as U1 on sheet dram; ComponentLink1Description: Manufacturer URL; ComponentLink2Description: Datasheet; DatasheetVersion: Rev. 2.3; ComponentLink3URL: http://cache.freescale.com/files/32bit/doc/data_sheet/IMX6DQCEC.pdf?fpsp=1&WT_TYPE=Data%20Sheets&WT_VENDOR=FREESCALE&WT_FILE_FORMAT=pdf&WT_ASSET=Documentation; ComponentLink1URL: http://www.freescale.com/; Packing: Tape and Reel; Temperature Range: -20 to 105 degC; ComponentLink2URL: http://cache.freescale.com/files/32bit/doc/data_sheet/IMX6DQCEC.pdf?fpsp=1&WT_TYPE=Data%20Sheets&WT_VENDOR=FREESCALE&WT_FILE_FORMAT=pdf&WT_ASSET=Documentation; ComponentLink3Description: Package Specification; PackageVersion: Rev. A; RoHS: TRUE; Quad/Dual CPU: i.MX 6Quad; Mounting Technology: Surface Mount; PackageReference: FCPBGA-624; PackageDescription: 624-pin Ball Grid Array Package, Body 21 x 21mm, Pitch 0.8mm

## Sheet jtag.SchDoc
size A4; SheetNumber: 12; SheetTotal: 21
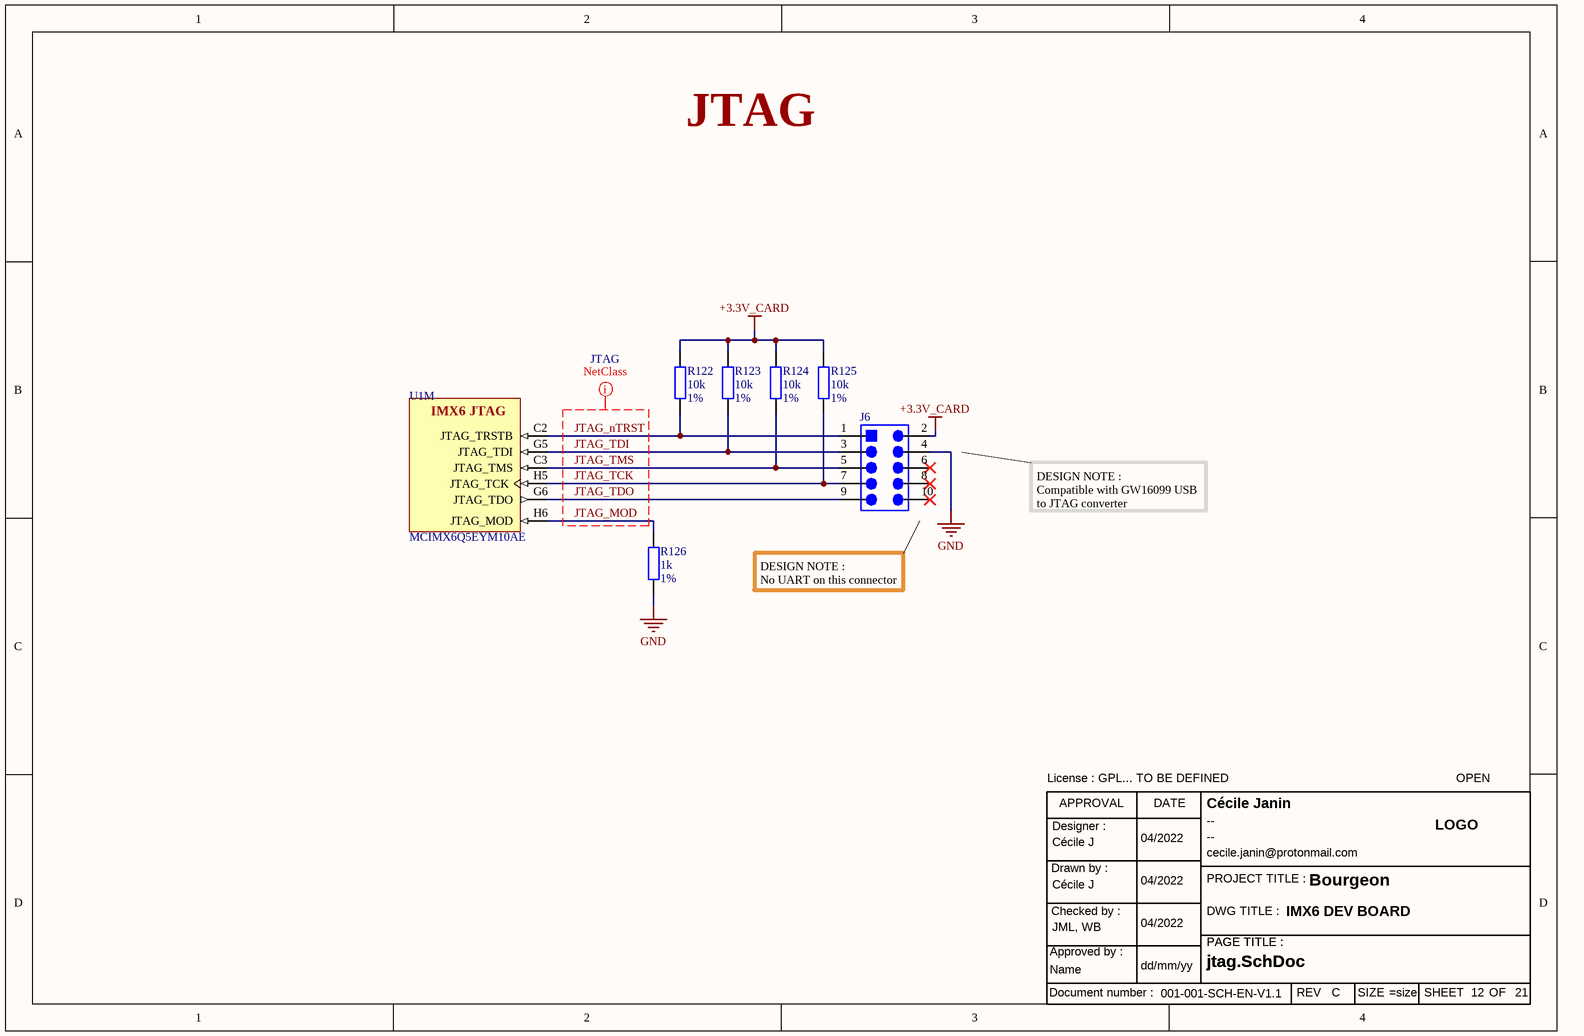
[diagram p14: jtag.SchDoc]

### Parts
J6  header 2 row x10  [header 2row x10]  (value not drawn)
R122  10k  pourcentage: 1%  [Res 0402/1005]
R123  10k  pourcentage: 1%  [Res 0402/1005]
R124  10k  pourcentage: 1%  [Res 0402/1005]
R125  10k  pourcentage: 1%  [Res 0402/1005]
R126  1k  pourcentage: 1%  [Res 0402/1005]
TB11  Title bloc ANSI modified  (value not drawn)
U1  MCIMX6Q5EYM10AE  [FRES-2197-01]  (part M of 21)

### Nets
+3.3V_CARD: J6.2 R122.2 R123.2 R124.2 R125.2
GND: J6.4 R126.1
JTAG_MOD: R126.2 U1.H6(JTAG_MOD)
JTAG_nTRST: J6.1 R122.1 U1.C2(JTAG_TRSTB)
JTAG_TCK: J6.7 R125.1 U1.H5(JTAG_TCK)
JTAG_TDI: J6.3 R123.1 U1.G5(JTAG_TDI)
JTAG_TDO: J6.9 U1.G6(JTAG_TDO)
JTAG_TMS: J6.5 R124.1 U1.C3(JTAG_TMS)

Not connected (* = marked no-connect by the designer): J6 6* 8* 10*

### Layout directives
net class JTAG: JTAG_MOD, JTAG_nTRST, JTAG_TCK, JTAG_TDI, JTAG_TDO, JTAG_TMS

### Notes on the sheet
- JTAG
- DESIGN NOTE :
  Compatible with GW16099 USB to JTAG converter
- DESIGN NOTE :
  No UART on this connector
- (in symbol IMX6Q5EYM10AE, part M) IMX6 JTAG
- (in symbol Title bloc ANSI) APPROVAL; DATE; Designer :; LOGO; Drawn by :; PROJECT TITLE :; Checked by :; DWG TITLE :; PAGE TITLE :; Approved by :; Document number :; REV; SIZE; SHEET; OF

### Library data of the parts
J6 = header 2 row x10: 62131021021
R122-R125 = res 10k 1%: res 10k 1% 0402
R126 = res 1k 1%: res 1k 1% 0402
TB11 = Title bloc ANSI
U1 = IMX6Q5EYM10AE: as U1 on sheet dram; ComponentLink1Description: Manufacturer URL; ComponentLink2Description: Datasheet; DatasheetVersion: Rev. 2.3; ComponentLink3URL: http://cache.freescale.com/files/32bit/doc/data_sheet/IMX6DQCEC.pdf?fpsp=1&WT_TYPE=Data%20Sheets&WT_VENDOR=FREESCALE&WT_FILE_FORMAT=pdf&WT_ASSET=Documentation; ComponentLink1URL: http://www.freescale.com/; Packing: Tape and Reel; Temperature Range: -20 to 105 degC; ComponentLink2URL: http://cache.freescale.com/files/32bit/doc/data_sheet/IMX6DQCEC.pdf?fpsp=1&WT_TYPE=Data%20Sheets&WT_VENDOR=FREESCALE&WT_FILE_FORMAT=pdf&WT_ASSET=Documentation; ComponentLink3Description: Package Specification; PackageVersion: Rev. A; RoHS: TRUE; Quad/Dual CPU: i.MX 6Quad; Mounting Technology: Surface Mount; PackageReference: FCPBGA-624; PackageDescription: 624-pin Ball Grid Array Package, Body 21 x 21mm, Pitch 0.8mm